# Altium project SML_Control_board.PrjPcb (part 1 of 2)
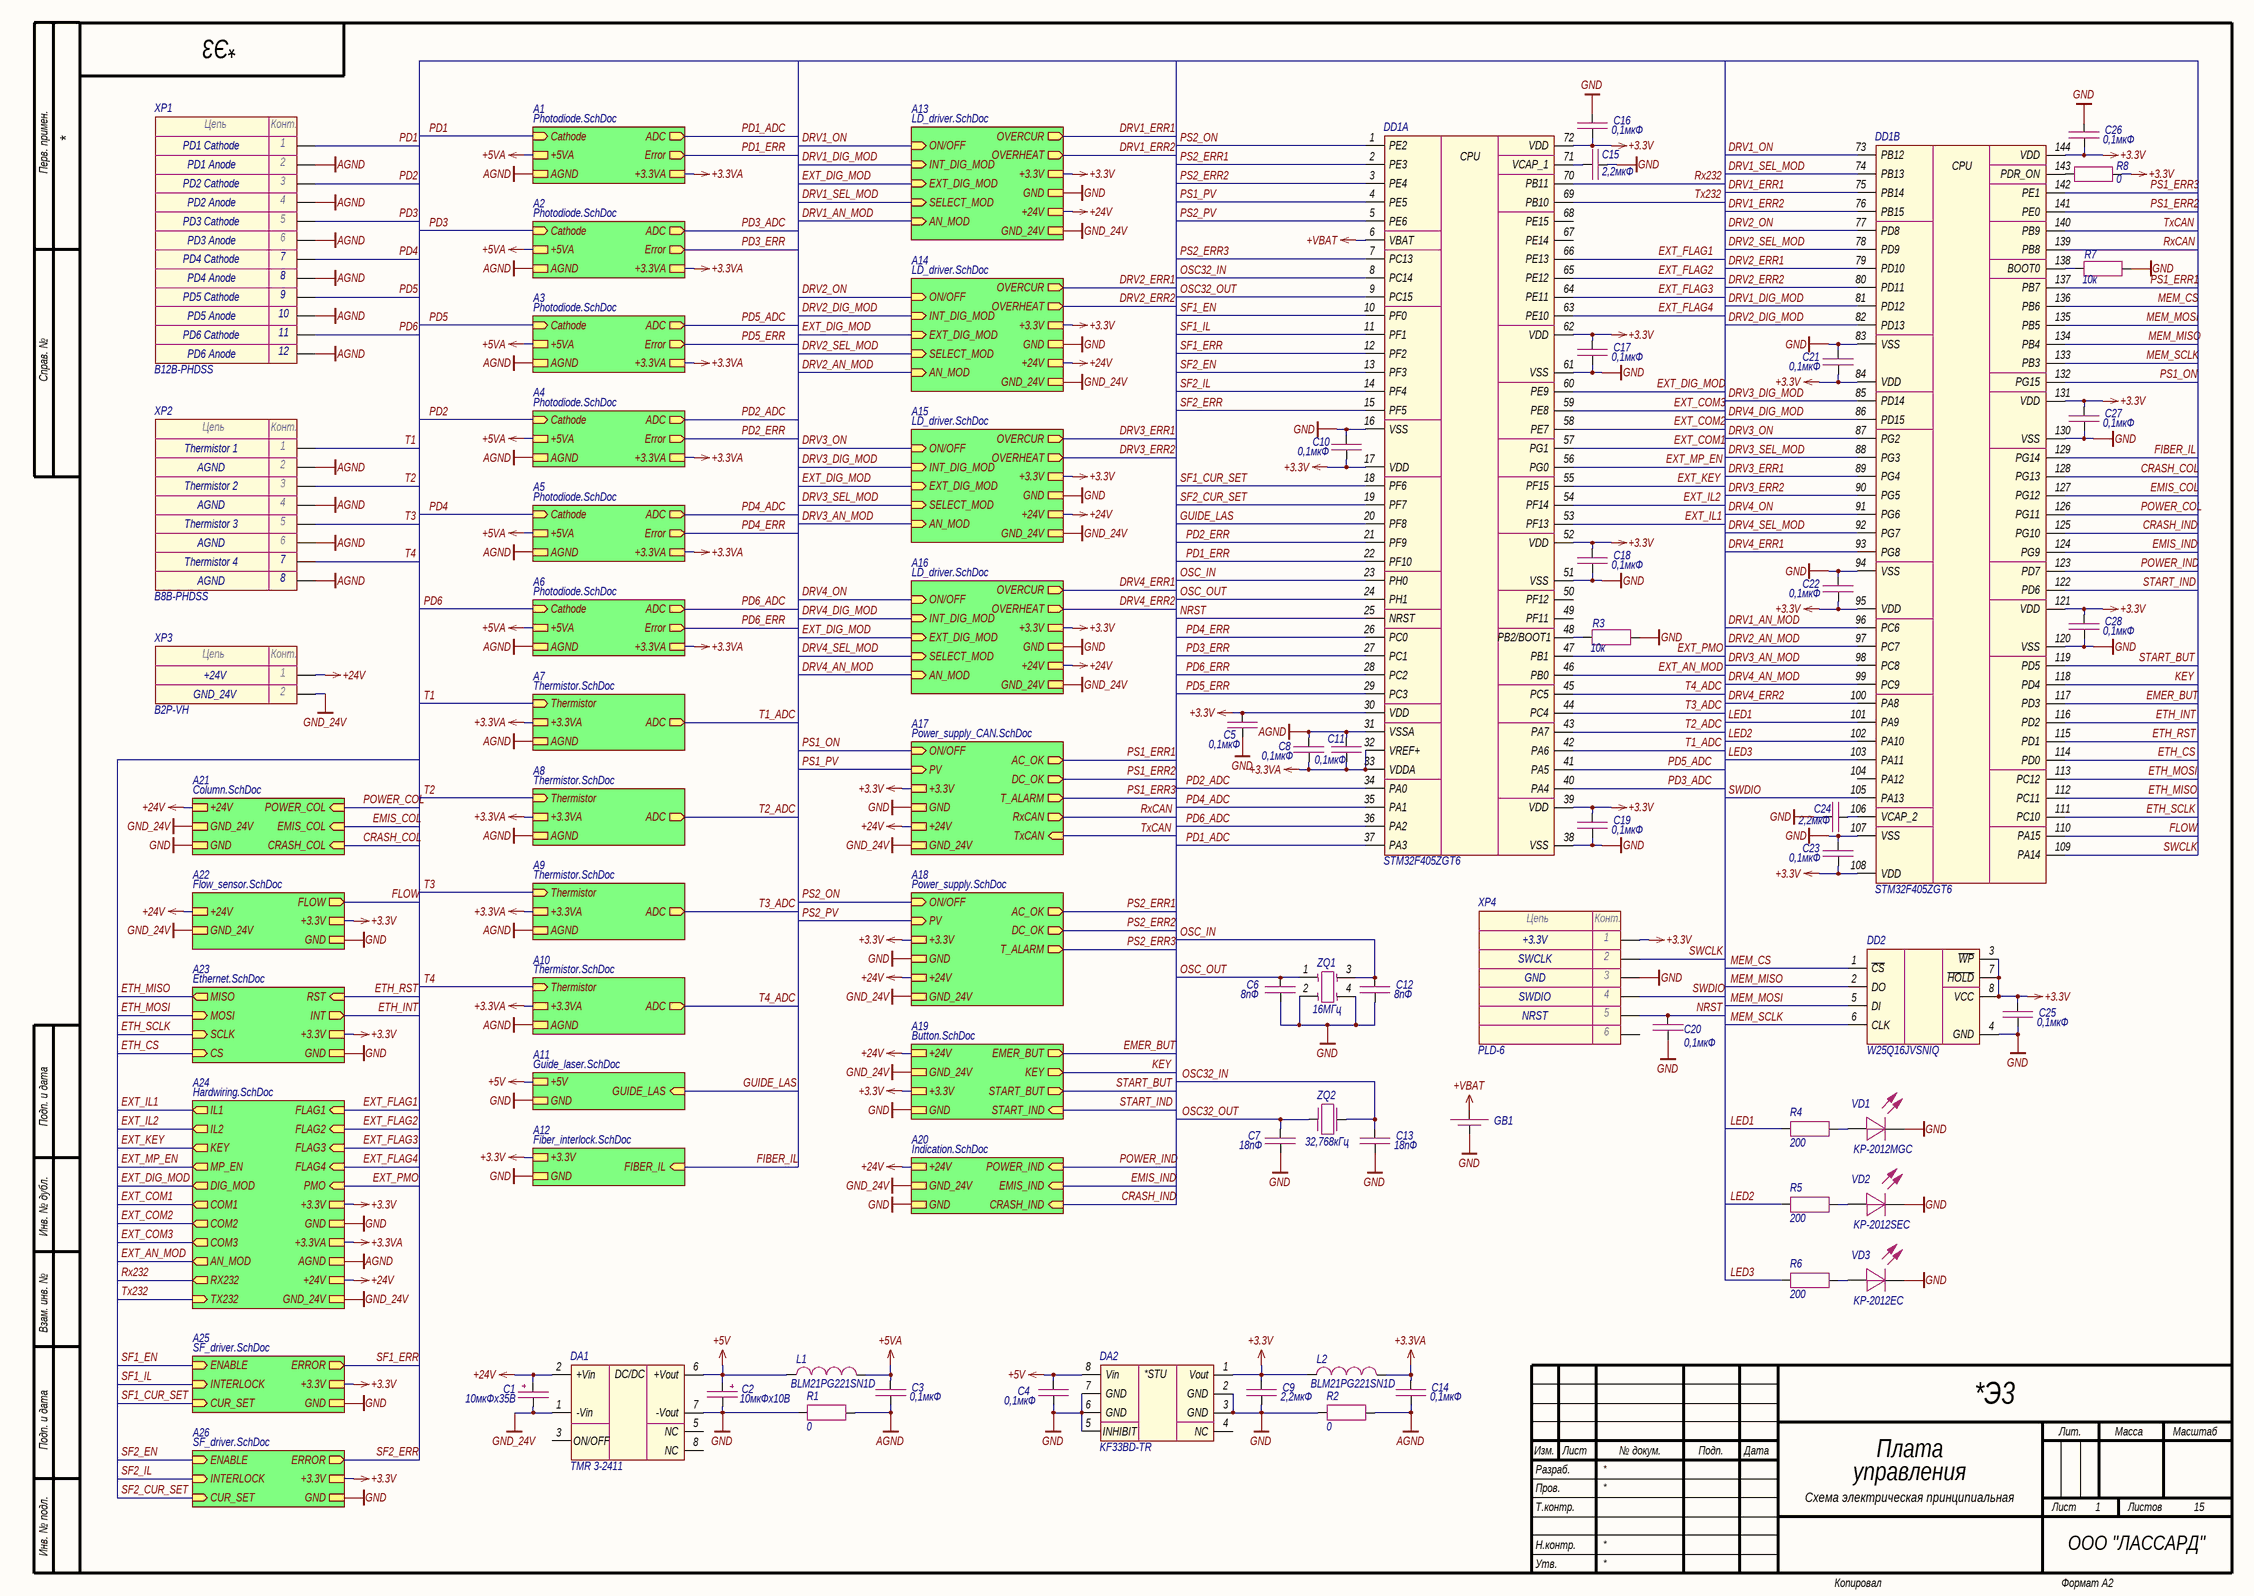
[diagram p0: Main.SchDoc]
15 sheets, 504 parts. Net scope: strictly hierarchical (ports join the sheet entries above them; power ports are local).
Board file: PCB1.PcbDoc
Sheets:
  Main.SchDoc
    A1 = Photodiode.SchDoc
    A2 = Photodiode.SchDoc
    A3 = Photodiode.SchDoc
    A4 = Photodiode.SchDoc
    A5 = Photodiode.SchDoc
    A6 = Photodiode.SchDoc
    A7 = Thermistor.SchDoc
    A8 = Thermistor.SchDoc
    A9 = Thermistor.SchDoc
    A10 = Thermistor.SchDoc
    A11 = Guide_laser.SchDoc
    A13 = LD_driver.SchDoc
    A14 = LD_driver.SchDoc
    A15 = LD_driver.SchDoc
    A16 = LD_driver.SchDoc
    A17 = Power_supply_CAN.SchDoc
    A18 = Power_supply.SchDoc
    A12 = Fiber_interlock.SchDoc
    A19 = Button.SchDoc
    A20 = Indication.SchDoc
    A21 = Column.SchDoc
    A22 = Flow_sensor.SchDoc
    A23 = Ethernet.SchDoc
    A24 = Hardwiring.SchDoc
    A25 = SF_driver.SchDoc
    A26 = SF_driver.SchDoc

## Sheet Main.SchDoc: Плата
size 594 x 420 mm; CompanyName: ООО "ЛАССАРД"; Address1: Address1; Address2: Address2; Address3: Address3; Address4: Address4; DocumentNumber: *Э3; SheetNumber: 1; SheetTotal: 15; Title2str: управления; DocumentType: Схема электрическая принципиальная

### Parts
C1  10мкФх35B  [CAP_C]
C2  10мкФх10B  [CAP_A]
C3  0,1мкФ  [CAP_0603]
C4  0,1мкФ  [CAP_0603]
C5  0,1мкФ  [CAP_0603]
C6  8пФ  [CAP_0603]
C7  18пФ  [CAP_0603]
C8  0,1мкФ  [CAP_0603]
C9  2,2мкФ  [CAP_0603]
C10  0,1мкФ  [CAP_0603]
C11  0,1мкФ  [CAP_0603]
C12  8пФ  [CAP_0603]
C13  18пФ  [CAP_0603]
C14  0,1мкФ  [CAP_0603]
C15  2,2мкФ  [CAP_0603]
C16  0,1мкФ  [CAP_0603]
C17  0,1мкФ  [CAP_0603]
C18  0,1мкФ  [CAP_0603]
C19  0,1мкФ  [CAP_0603]
C20  0,1мкФ  [CAP_0603]
C21  0,1мкФ  [CAP_0603]
C22  0,1мкФ  [CAP_0603]
C23  0,1мкФ  [CAP_0603]
C24  2,2мкФ  [CAP_0603]
C25  0,1мкФ  [CAP_0603]
C26  0,1мкФ  [CAP_0603]
C27  0,1мкФ  [CAP_0603]
C28  0,1мкФ  [CAP_0603]
DA1  TMR 3-2411  [TMR3 (SIP-8)]
DA2  KF33BD-TR  [SOIC-8]
DD1  STM32F405ZGT6  [LQFP-144]  (parts A,B of 2)
DD2  W25Q16JVSNIQ  [SOIC-8]
GB1  DS1092-12-N8S  [DS1092-12-N8S]  (value not drawn)
L1  BLM21PG221SN1D  [IND_0805]
L2  BLM21PG221SN1D  [IND_0805]
R1  0  [RES_0805]
R2  0  [RES_0805]
R3  10к  [RES_0603]
R4  200  [RES_0603]
R5  200  [RES_0603]
R6  200  [RES_0603]
R7  10к  [RES_0603]
R8  0  [RES_0603]
VD1  KP-2012MGC  [LED_0805]
VD2  KP-2012SEC  [LED_0805]
VD3  KP-2012EC  [LED_0805]
XP1  B12B-PHDSS  [B12B-PHDSS]
XP2  B8B-PHDSS  [B8B-PHDSS]
XP3  B2P-VH  [B2P-VH]
XP4  PLD-6  [PLD-6]
ZQ1  16МГц  [NX2520SA]
ZQ2  32,768кГц  [NX3215SA]

### Sub-sheets
A1 = Photodiode.SchDoc: Cathode (in), ADC (out), Error (out), AGND, +5VA, +3.3VA
A2 = Photodiode.SchDoc: Cathode (in), ADC (out), Error (out), AGND, +5VA, +3.3VA
A3 = Photodiode.SchDoc: Cathode (in), ADC (out), Error (out), AGND, +5VA, +3.3VA
A4 = Photodiode.SchDoc: Cathode (in), ADC (out), Error (out), AGND, +5VA, +3.3VA
A5 = Photodiode.SchDoc: Cathode (in), ADC (out), Error (out), AGND, +5VA, +3.3VA
A6 = Photodiode.SchDoc: Cathode (in), ADC (out), Error (out), AGND, +5VA, +3.3VA
A7 = Thermistor.SchDoc: Thermistor (in), +3.3VA, AGND, ADC (out)
A8 = Thermistor.SchDoc: Thermistor (in), +3.3VA, AGND, ADC (out)
A9 = Thermistor.SchDoc: Thermistor (in), +3.3VA, AGND, ADC (out)
A10 = Thermistor.SchDoc: Thermistor (in), +3.3VA, AGND, ADC (out)
A11 = Guide_laser.SchDoc: GUIDE_LAS (in), +5V, GND
A12 = Fiber_interlock.SchDoc: FIBER_IL (in), +3.3V, GND
A13 = LD_driver.SchDoc: +3.3V, GND, OVERCUR (out), OVERHEAT (out), +24V, GND_24V, ON/OFF (in), INT_DIG_MOD (in), AN_MOD (in), EXT_DIG_MOD (in), SELECT_MOD (in)
A14 = LD_driver.SchDoc: +3.3V, GND, OVERCUR (out), OVERHEAT (out), +24V, GND_24V, ON/OFF (in), INT_DIG_MOD (in), AN_MOD (in), EXT_DIG_MOD (in), SELECT_MOD (in)
A15 = LD_driver.SchDoc: +3.3V, GND, OVERCUR (out), OVERHEAT (out), +24V, GND_24V, ON/OFF (in), INT_DIG_MOD (in), AN_MOD (in), EXT_DIG_MOD (in), SELECT_MOD (in)
A16 = LD_driver.SchDoc: +3.3V, GND, OVERCUR (out), OVERHEAT (out), +24V, GND_24V, ON/OFF (in), INT_DIG_MOD (in), AN_MOD (in), EXT_DIG_MOD (in), SELECT_MOD (in)
A17 = Power_supply_CAN.SchDoc: ON/OFF (in), PV (in), +3.3V, GND, +24V, GND_24V, AC_OK (out), DC_OK (out), RxCAN (out), TxCAN (in), T_ALARM (out)
A18 = Power_supply.SchDoc: ON/OFF (in), PV (in), +3.3V, GND, +24V, GND_24V, AC_OK (out), DC_OK (out), T_ALARM (out)
A19 = Button.SchDoc: EMER_BUT (out), +24V, GND_24V, +3.3V, GND, KEY (out), START_BUT (out), START_IND (in)
A20 = Indication.SchDoc: GND_24V, +24V, CRASH_IND (in), POWER_IND (in), EMIS_IND (in), GND
A21 = Column.SchDoc: GND_24V, +24V, CRASH_COL (in), POWER_COL (in), EMIS_COL (in), GND
A22 = Flow_sensor.SchDoc: FLOW (out), +24V, GND_24V, +3.3V, GND
A23 = Ethernet.SchDoc: MISO (out), RST (in), MOSI (in), INT (out), SCLK (in), CS (in), +3.3V, GND
A24 = Hardwiring.SchDoc: IL1 (out), FLAG1 (in), RX232 (out), TX232 (in), IL2 (out), KEY (out), MP_EN (out), AN_MOD (out), FLAG2 (in), FLAG3 (in), FLAG4 (in), PMO (in), +3.3VA, AGND, +3.3V, GND, GND_24V, +24V, COM1 (out), COM2 (out), COM3 (out), DIG_MOD (out)
A25 = SF_driver.SchDoc: ENABLE (in), ERROR (out), +3.3V, GND, INTERLOCK (in), CUR_SET (in)
A26 = SF_driver.SchDoc: ENABLE (in), ERROR (out), +3.3V, GND, INTERLOCK (in), CUR_SET (in)

### Nets
+3.3V: C5.1 C9.1 C10.2 C16.2 C17.1 C18.1 C19.1 C21.2 C22.2 C23.2 C25.1 C26.2 C27.1 C28.1 DA2.1(Vout) DD1.17(VDD) DD1.30(VDD) DD1.39(VDD) DD1.52(VDD) DD1.62(VDD) DD1.72(VDD) DD1.84(VDD) DD1.95(VDD) DD1.108(VDD) DD1.121(VDD) DD1.131(VDD) DD1.144(VDD) DD2.3(~{WP}) DD2.7(~{HOLD}) DD2.8(VCC) L2.1 R8.2 XP4.1 ; sheet A13/+3.3V, sheet A14/+3.3V, sheet A15/+3.3V, sheet A16/+3.3V, sheet A17/+3.3V, sheet A18/+3.3V, sheet A12/+3.3V, sheet A19/+3.3V, sheet A22/+3.3V, sheet A23/+3.3V, sheet A24/+3.3V, sheet A25/+3.3V, sheet A26/+3.3V
+3.3VA: C8.2 C11.2 C14.1 DD1.32(VREF+) DD1.33(VDDA) L2.2 ; sheet A1/+3.3VA, sheet A2/+3.3VA, sheet A3/+3.3VA, sheet A4/+3.3VA, sheet A5/+3.3VA, sheet A6/+3.3VA, sheet A7/+3.3VA, sheet A8/+3.3VA, sheet A9/+3.3VA, sheet A10/+3.3VA, sheet A24/+3.3VA
+5V: C2.1 C4.1 DA1.6(+Vout) DA2.8(Vin) L1.1 ; sheet A11/+5V
+5VA: C3.1 L1.2 ; sheet A1/+5VA, sheet A2/+5VA, sheet A3/+5VA, sheet A4/+5VA, sheet A5/+5VA, sheet A6/+5VA
+24V: C1.1 DA1.2(+Vin) XP3.1 ; sheet A13/+24V, sheet A14/+24V, sheet A15/+24V, sheet A16/+24V, sheet A17/+24V, sheet A18/+24V, sheet A19/+24V, sheet A20/+24V, sheet A21/+24V, sheet A22/+24V, sheet A24/+24V
+VBAT: DD1.6(VBAT) GB1.2
AGND: C3.2 C8.1 C11.1 C14.2 DD1.31(VSSA) R1.2 R2.2 XP1.2 XP1.4 XP1.6 XP1.8 XP1.10 XP1.12 XP2.2 XP2.4 XP2.6 XP2.8 ; sheet A1/AGND, sheet A2/AGND, sheet A3/AGND, sheet A4/AGND, sheet A5/AGND, sheet A6/AGND, sheet A7/AGND, sheet A8/AGND, sheet A9/AGND, sheet A10/AGND, sheet A24/AGND
GND: C2.2 C4.2 C5.2 C6.2 C7.2 C9.2 C10.1 C12.2 C13.2 C15.2 C16.1 C17.2 C18.2 C19.2 C20.2 C21.1 C22.1 C23.1 C24.2 C25.2 C26.1 C27.2 C28.2 DA1.7(-Vout) DA2.2(GND) DA2.3(GND) DA2.5(INHIBIT) DA2.6(GND) DA2.7(GND) DD1.16(VSS) DD1.38(VSS) DD1.51(VSS) DD1.61(VSS) DD1.83(VSS) DD1.94(VSS) DD1.107(VSS) DD1.120(VSS) DD1.130(VSS) DD2.4(GND) GB1.1 R1.1 R2.1 R3.2 R7.2 VD1.2(C) VD2.2(C) VD3.2(C) XP4.3 ZQ1.2 ZQ1.4 ; sheet A11/GND, sheet A13/GND, sheet A14/GND, sheet A15/GND, sheet A16/GND, sheet A17/GND, sheet A18/GND, sheet A12/GND, sheet A19/GND, sheet A20/GND, sheet A21/GND, sheet A22/GND, sheet A23/GND, sheet A24/GND, sheet A25/GND, sheet A26/GND
GND_24V: C1.2 DA1.1(-Vin) XP3.2 ; sheet A13/GND_24V, sheet A14/GND_24V, sheet A15/GND_24V, sheet A16/GND_24V, sheet A17/GND_24V, sheet A18/GND_24V, sheet A19/GND_24V, sheet A20/GND_24V, sheet A21/GND_24V, sheet A22/GND_24V, sheet A24/GND_24V
CRASH_COL: DD1.128(PG13) ; sheet A21/CRASH_COL
CRASH_IND: DD1.125(PG10) ; sheet A20/CRASH_IND
DRV1_AN_MOD: DD1.96(PC6) ; sheet A13/AN_MOD
DRV1_DIG_MOD: DD1.81(PD12) ; sheet A13/INT_DIG_MOD
DRV1_ERR1: DD1.75(PB14) ; sheet A13/OVERCUR
DRV1_ERR2: DD1.76(PB15) ; sheet A13/OVERHEAT
DRV1_ON: DD1.73(PB12) ; sheet A13/ON/OFF
DRV1_SEL_MOD: DD1.74(PB13) ; sheet A13/SELECT_MOD
DRV2_AN_MOD: DD1.97(PC7) ; sheet A14/AN_MOD
DRV2_DIG_MOD: DD1.82(PD13) ; sheet A14/INT_DIG_MOD
DRV2_ERR1: DD1.79(PD10) ; sheet A14/OVERCUR
DRV2_ERR2: DD1.80(PD11) ; sheet A14/OVERHEAT
DRV2_ON: DD1.77(PD8) ; sheet A14/ON/OFF
DRV2_SEL_MOD: DD1.78(PD9) ; sheet A14/SELECT_MOD
DRV3_AN_MOD: DD1.98(PC8) ; sheet A15/AN_MOD
DRV3_DIG_MOD: DD1.85(PD14) ; sheet A15/INT_DIG_MOD
DRV3_ERR1: DD1.89(PG4) ; sheet A15/OVERCUR
DRV3_ERR2: DD1.90(PG5) ; sheet A15/OVERHEAT
DRV3_ON: DD1.87(PG2) ; sheet A15/ON/OFF
DRV3_SEL_MOD: DD1.88(PG3) ; sheet A15/SELECT_MOD
DRV4_AN_MOD: DD1.99(PC9) ; sheet A16/AN_MOD
DRV4_DIG_MOD: DD1.86(PD15) ; sheet A16/INT_DIG_MOD
DRV4_ERR1: DD1.93(PG8) ; sheet A16/OVERCUR
DRV4_ERR2: DD1.100(PA8) ; sheet A16/OVERHEAT
DRV4_ON: DD1.91(PG6) ; sheet A16/ON/OFF
DRV4_SEL_MOD: DD1.92(PG7) ; sheet A16/SELECT_MOD
EMER_BUT: DD1.117(PD3) ; sheet A19/EMER_BUT
EMIS_COL: DD1.127(PG12) ; sheet A21/EMIS_COL
EMIS_IND: DD1.124(PG9) ; sheet A20/EMIS_IND
ETH_CS: DD1.114(PD0) ; sheet A23/CS
ETH_INT: DD1.116(PD2) ; sheet A23/INT
ETH_MISO: DD1.112(PC11) ; sheet A23/MISO
ETH_MOSI: DD1.113(PC12) ; sheet A23/MOSI
ETH_RST: DD1.115(PD1) ; sheet A23/RST
ETH_SCLK: DD1.111(PC10) ; sheet A23/SCLK
EXT_AN_MOD: DD1.46(PB0) ; sheet A24/AN_MOD
EXT_COM1: DD1.57(PG1) ; sheet A24/COM1
EXT_COM2: DD1.58(PE7) ; sheet A24/COM2
EXT_COM3: DD1.59(PE8) ; sheet A24/COM3
EXT_DIG_MOD: DD1.60(PE9) ; sheet A13/EXT_DIG_MOD, sheet A14/EXT_DIG_MOD, sheet A15/EXT_DIG_MOD, sheet A16/EXT_DIG_MOD, sheet A24/DIG_MOD
EXT_FLAG1: DD1.66(PE13) ; sheet A24/FLAG1
EXT_FLAG2: DD1.65(PE12) ; sheet A24/FLAG2
EXT_FLAG3: DD1.64(PE11) ; sheet A24/FLAG3
EXT_FLAG4: DD1.63(PE10) ; sheet A24/FLAG4
EXT_IL1: DD1.53(PF13) ; sheet A24/IL1
EXT_IL2: DD1.54(PF14) ; sheet A24/IL2
EXT_KEY: DD1.55(PF15) ; sheet A24/KEY
EXT_MP_EN: DD1.56(PG0) ; sheet A24/MP_EN
EXT_PMO: DD1.47(PB1) ; sheet A24/PMO
FIBER_IL: DD1.129(PG14) ; sheet A12/FIBER_IL
FLOW: DD1.110(PA15) ; sheet A22/FLOW
GUIDE_LAS: DD1.20(PF8) ; sheet A11/GUIDE_LAS
KEY: DD1.118(PD4) ; sheet A19/KEY
LED1: DD1.101(PA9) R4.1
LED2: DD1.102(PA10) R5.1
LED3: DD1.103(PA11) R6.1
MEM_CS: DD1.136(PB6) DD2.1(~{CS})
MEM_MISO: DD1.134(PB4) DD2.2(DO)
MEM_MOSI: DD1.135(PB5) DD2.5(DI)
MEM_SCLK: DD1.133(PB3) DD2.6(CLK)
NRST: C20.1 DD1.25(NRST) XP4.5
OSC32_IN: C13.1 DD1.8(PC14) ZQ2.2
OSC32_OUT: C7.1 DD1.9(PC15) ZQ2.1
OSC_IN: C12.1 DD1.23(PH0) ZQ1.3
OSC_OUT: C6.1 DD1.24(PH1) ZQ1.1
PD1: XP1.1 ; sheet A1/Cathode
PD1_ADC: DD1.37(PA3) ; sheet A1/ADC
PD1_ERR: DD1.22(PF10) ; sheet A1/Error
PD2: XP1.3 ; sheet A4/Cathode
PD2_ADC: DD1.34(PA0) ; sheet A4/ADC
PD2_ERR: DD1.21(PF9) ; sheet A4/Error
PD3: XP1.5 ; sheet A2/Cathode
PD3_ADC: DD1.40(PA4) ; sheet A2/ADC
PD3_ERR: DD1.27(PC1) ; sheet A2/Error
PD4: XP1.7 ; sheet A5/Cathode
PD4_ADC: DD1.35(PA1) ; sheet A5/ADC
PD4_ERR: DD1.26(PC0) ; sheet A5/Error
PD5: XP1.9 ; sheet A3/Cathode
PD5_ADC: DD1.41(PA5) ; sheet A3/ADC
PD5_ERR: DD1.29(PC3) ; sheet A3/Error
PD6: XP1.11 ; sheet A6/Cathode
PD6_ADC: DD1.36(PA2) ; sheet A6/ADC
PD6_ERR: DD1.28(PC2) ; sheet A6/Error
POWER_COL: DD1.126(PG11) ; sheet A21/POWER_COL
POWER_IND: DD1.123(PD7) ; sheet A20/POWER_IND
PS1_ERR1: DD1.137(PB7) ; sheet A17/AC_OK
PS1_ERR2: DD1.141(PE0) ; sheet A17/DC_OK
PS1_ERR3: DD1.142(PE1) ; sheet A17/T_ALARM
PS1_ON: DD1.132(PG15) ; sheet A17/ON/OFF
PS1_PV: DD1.4(PE5) ; sheet A17/PV
PS2_ERR1: DD1.2(PE3) ; sheet A18/AC_OK
PS2_ERR2: DD1.3(PE4) ; sheet A18/DC_OK
PS2_ERR3: DD1.7(PC13) ; sheet A18/T_ALARM
PS2_ON: DD1.1(PE2) ; sheet A18/ON/OFF
PS2_PV: DD1.5(PE6) ; sheet A18/PV
Rx232: DD1.70(PB11) ; sheet A24/RX232
RxCAN: DD1.139(PB8) ; sheet A17/RxCAN
SF1_CUR_SET: DD1.18(PF6) ; sheet A25/CUR_SET
SF1_EN: DD1.10(PF0) ; sheet A25/ENABLE
SF1_ERR: DD1.12(PF2) ; sheet A25/ERROR
SF1_IL: DD1.11(PF1) ; sheet A25/INTERLOCK
SF2_CUR_SET: DD1.19(PF7) ; sheet A26/CUR_SET
SF2_EN: DD1.13(PF3) ; sheet A26/ENABLE
SF2_ERR: DD1.15(PF5) ; sheet A26/ERROR
SF2_IL: DD1.14(PF4) ; sheet A26/INTERLOCK
START_BUT: DD1.119(PD5) ; sheet A19/START_BUT
START_IND: DD1.122(PD6) ; sheet A19/START_IND
SWCLK: DD1.109(PA14) XP4.2
SWDIO: DD1.105(PA13) XP4.4
T1: XP2.1 ; sheet A7/Thermistor
T1_ADC: DD1.42(PA6) ; sheet A7/ADC
T2: XP2.3 ; sheet A8/Thermistor
T2_ADC: DD1.43(PA7) ; sheet A8/ADC
T3: XP2.5 ; sheet A9/Thermistor
T3_ADC: DD1.44(PC4) ; sheet A9/ADC
T4: XP2.7 ; sheet A10/Thermistor
T4_ADC: DD1.45(PC5) ; sheet A10/ADC
Tx232: DD1.69(PB10) ; sheet A24/TX232
TxCAN: DD1.140(PB9) ; sheet A17/TxCAN
NetC15_1: C15.1 DD1.71(VCAP_1)
NetC24_1: C24.1 DD1.106(VCAP_2)
NetDD1_48: DD1.48(PB2/BOOT1) R3.1
NetDD1_138: DD1.138(BOOT0) R7.1
NetDD1_143: DD1.143(PDR_ON) R8.1
NetR4_2: R4.2 VD1.1(A)
NetR5_2: R5.2 VD2.1(A)
NetR6_2: R6.2 VD3.1(A)

Not connected (* = marked no-connect by the designer): DA1 3(ON/OFF) 5(NC) 8(NC); DA2 4(NC); DD1 49(PF11) 50(PF12) 67(PE14) 68(PE15) 104(PA12); XP4 6

### Notes on the sheet
- PD1 Cathode
- PD1 Anode
- PD2 Cathode
- PD2 Anode
- PD3 Cathode
- PD3 Anode
- PD4 Cathode
- PD4 Anode
- PD5 Cathode
- PD5 Anode
- PD6 Cathode
- PD6 Anode
- Thermistor 1
- AGND
- Thermistor 2
- Thermistor 3
- Thermistor 4
- +24V
- GND_24V
- +3.3V
- GND
- SWCLK
- SWDIO
- NRST
- Перв. примен.
- Справ. №
- Подп. и дата
- Инв. № дубл.
- Взам. инв. №
- Разраб.
- Изм.
- Лист
- № докум.
- Подп.
- Дата
- Лит.
- Масса
- Масштаб
- Пров.
- Т.контр.
- Листов
- Инв. № подл.
- Утв.
- Н.контр.
- Копировал
- Формат А2
- (in symbol Connector-2) Цепь; Конт.
- (in symbol Connector-8) Цепь; Конт.
- (in symbol Connector-12) Цепь; Конт.
- (in symbol KFXXBD-TR) *STU
- (in symbol STM32F405ZG, part A) CPU
- (in symbol STM32F405ZG, part B) CPU
- (in symbol TMR3) DC/DC

### Library data of the parts
C1 = Capacitor_Polar: Model: TECAP, 10 мкФ, 35 В, тип C, 10%; Value: 10мкФх35B; Document: *; Manufacturer: *
C2 = Capacitor_Polar: Model: TECAP, 10 мкФ, 10 В, тип A, 10%; Value: 10мкФх10B; Document: *; Manufacturer: *
C3-C5 C8 C10 C11 C14 C16-C23 C25-C28 = Capacitor: Manufacturer: Murata; Model: GRM188R71H104KA93D; Value: 0,1мкФ; Document: *
C6 C12 = Capacitor: Manufacturer: Yageo; Model: CC0603CRNPO9BN8R0; Value: 8пФ; Document: *
C7 C13 = Capacitor: Manufacturer: Murata; Model: GRM1885C1H180FA01D; Value: 18пФ; Document: *
C9 C15 C24 = Capacitor: Manufacturer: Murata; Model: GRM188R61H225KE11D; Value: 2,2мкФ; Document: *
DA1 = TMR3: Manufacturer: Traco Power; Model: TMR 3-2411; Document: *
DA2 = KFXXBD-TR: Manufacturer: STMicroelectronics; Model: KF33BD-TR; Document: *
DD1 = STM32F405ZG: Manufacturer: STMicroelectronics; Model: STM32F405ZGT6; Document: *
DD2 = W25Q: Manufacturer: Winbond; Model: W25Q16JVSNIQ; Document: *
GB1 = Accumulator: Manufacturer: Connfly; Model: DS1092-12-N8S; Document: *
L1 L2 = Inductor: Manufacturer: Murata; Value: *; Model: BLM21PG221SN1D; Document: *
R1 R2 = Resistor: Manufacturer: Yageo; Model: RC0805FR-070RL; Value: 0; Document: *
R3 R7 = Resistor: Manufacturer: Yageo; Model: RC0603FR-0710KL; Value: 10к; Document: *
R4-R6 = Resistor: Manufacturer: Yageo; Model: RC0603FR-07200RL; Value: 200; Document: *
R8 = Resistor: Manufacturer: Yageo; Model: RC0603JR-070RL; Value: 0; Document: *
VD1-VD3 = LED: Manufacturer: Kingbright; Document: *
  VD1: Model: KP-2012MGC
  VD2: Model: KP-2012SEC
  VD3: Model: KP-2012EC
XP1 = Connector-12: Manufacturer: JST; Model: B12B-PHDSS; Document: *
XP2 = Connector-8: Manufacturer: JST; Model: B8B-PHDSS; Document: *
XP3 = Connector-2: Manufacturer: JST; Model: B2P-VH; Document: *
XP4 = Connector-6: Manufacturer: Connfly; Model: PLD-6; Document: *
ZQ1 = Quartz_Resonator_4-pin: Manufacturer: NDK; Model: NX2520SA-16MHZ-STD-CSW-5; Value: 16МГц; Document: *
ZQ2 = Quartz_Resonator: Manufacturer: NDK; Model: NX3215SA- 32.768K-STD-MUA-8; Value: 32,768кГц; Document: *

## Sheet Photodiode.SchDoc
size 420 x 297 mm; Address1: Address1; Address2: Address2; Address3: Address3; Address4: Address4; DocumentNumber: *Э3; SheetNumber: 2; SheetTotal: 15; DocumentType: Схема электрическая *
Used 6 times, as channels A1, A2, A3, A4, A5, A6. Parts and nets are listed once, with the designators drawn on the sheet.
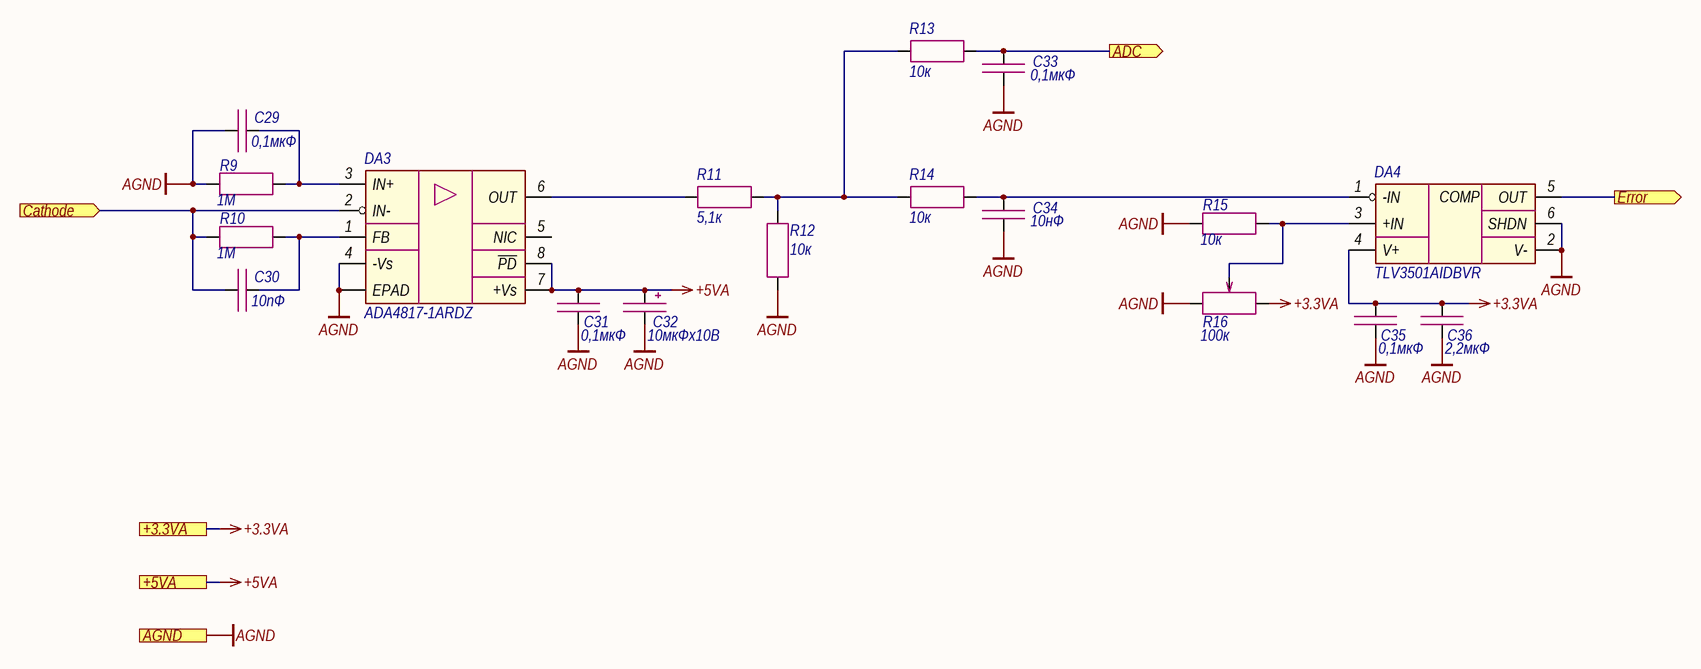
[diagram p1: Photodiode.SchDoc]

### Parts
C29  0,1мкФ  [CAP_0603]
C30  10пФ  [CAP_0603]
C31  0,1мкФ  [CAP_0603]
C32  10мкФх10B  [CAP_A]
C33  0,1мкФ  [CAP_0603]
C34  10нФ  [CAP_0603]
C35  0,1мкФ  [CAP_0603]
C36  2,2мкФ  [CAP_0603]
DA3  ADA4817-1ARDZ  [SOIC-8 EPAD]
DA4  TLV3501AIDBVR  [SOT-23-6]
R9  1М  [RES_0805]
R10  1М  [RES_0805]
R11  5,1к  [RES_0603]
R12  10к  [RES_0603]
R13  10к  [RES_0603]
R14  10к  [RES_0603]
R15  10к  [RES_0603]
R16  100к  [3224W]

### Ports
+3.3VA (see Main[2A], Hardwiring[4D], Thermistor[2C]), +5VA (see Main[1A]), ADC (out, see Main[2A]), AGND (see Main[1A], Hardwiring[4D], Thermistor[2C]), Cathode (in, see Main[1A]), Error (out, see Main[2A])

### Nets
+3.3VA: C35.1 C36.1 DA4.4(V+) R16.3 ; port +3.3VA
+5VA: C31.1 C32.1 DA3.7(+Vs) DA3.8(~{PD}) ; port +5VA
AGND: C29.1 C31.2 C32.2 C33.2 C34.2 C35.2 C36.2 DA3.4(-Vs) DA3.EPAD DA4.2(V-) DA4.6(SHDN) R9.2 R12.2 R15.1 R16.1 ; port AGND
ADC: C33.1 R13.2 ; port ADC
Cathode: C30.2 DA3.2(IN-) R10.2 ; port Cathode
Error: DA4.5(OUT) ; port Error
NetC29_2: C29.2 DA3.3(IN+) R9.1
NetC30_1: C30.1 DA3.1(FB) R10.1
NetC34_1: C34.1 DA4.1(-IN) R14.2
NetDA3_6: DA3.6(OUT) R11.1
NetDA4_3: DA4.3(+IN) R15.2 R16.2
NetR11_2: R11.2 R12.1 R13.1 R14.1

Not connected (* = marked no-connect by the designer): DA3 5(NIC)

### Channels
A1: designators end in A1; ports +3.3VA=+3.3VA +5VA=+5VA ADC=PD1_ADC AGND=AGND Cathode=PD1 Error=PD1_ERR
A2: designators end in A2; ports +3.3VA=+3.3VA +5VA=+5VA ADC=PD3_ADC AGND=AGND Cathode=PD3 Error=PD3_ERR
A3: designators end in A3; ports +3.3VA=+3.3VA +5VA=+5VA ADC=PD5_ADC AGND=AGND Cathode=PD5 Error=PD5_ERR
A4: designators end in A4; ports +3.3VA=+3.3VA +5VA=+5VA ADC=PD2_ADC AGND=AGND Cathode=PD2 Error=PD2_ERR
A5: designators end in A5; ports +3.3VA=+3.3VA +5VA=+5VA ADC=PD4_ADC AGND=AGND Cathode=PD4 Error=PD4_ERR
A6: designators end in A6; ports +3.3VA=+3.3VA +5VA=+5VA ADC=PD6_ADC AGND=AGND Cathode=PD6 Error=PD6_ERR

### Notes on the sheet
- Подп. и дата
- Инв. № дубл.
- Взам. инв. №
- Инв. № подл.
- Изм.
- Лист
- № докум.
- Подп.
- Дата
- Копировал
- Формат А3
- (in symbol TLV3501) COMP

### Library data of the parts
C29 C31 C33 C35 = Capacitor: as C3 on sheet Main; Value: 0,1мкФ; Document: *
C30 = Capacitor: Manufacturer: Murata; Model: GRM1885C1H100JA01D; Value: 10пФ; Document: *
C32 = Capacitor_Polar: Model: TECAP, 10 мкФ, 10 В, тип A, 10%; Value: 10мкФх10B; Document: *; Manufacturer: *
C34 = Capacitor: Manufacturer: Murata; Model: GRM188R71H103JA01D; Value: 10нФ; Document: *
C36 = Capacitor: as C9 on sheet Main; Value: 2,2мкФ; Document: *
DA3 = ADA4817-1ARDZ: Manufacturer: Analog Devices; Model: ADA4817-1ARDZ; Document: *
DA4 = TLV3501: Manufacturer: Texas Instruments; Model: TLV3501AIDBVR; Document: *
R9 R10 = Resistor: Manufacturer: Yageo; Model: RC0805FR-071ML; Value: 1М; Document: *
R11 = Resistor: Manufacturer: Yageo; Model: RC0603FR-075K1L; Value: 5,1к; Document: *
R12-R15 = Resistor: as R3 on sheet Main; Value: 10к; Document: *
R16 = Resistor_Variable: Manufacturer: Bourns; Model: 3224W-1-104E; Value: 100к; Document: *

## Sheet Thermistor.SchDoc
size 209 x 297 mm; Address1: Address1; Address2: Address2; Address3: Address3; Address4: Address4; DocumentNumber: *Э3; SheetNumber: 3; SheetTotal: 15; DocumentType: Схема электрическая *
Used 4 times, as channels A7, A8, A9, A10. Parts and nets are listed once, with the designators drawn on the sheet.
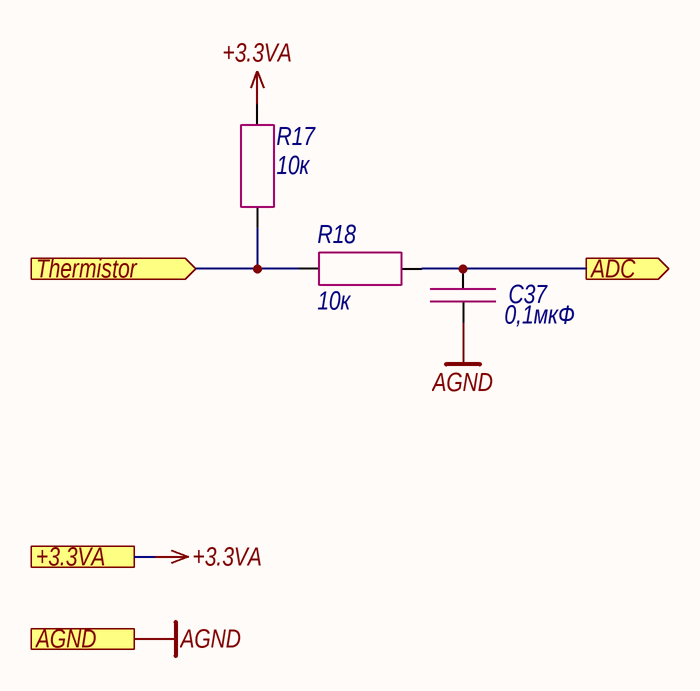
[diagram p2: Thermistor.SchDoc]

### Parts
C37  0,1мкФ  [CAP_0603]
R17  10к  [RES_0603]
R18  10к  [RES_0603]

### Ports
+3.3VA (see Main[1B], Hardwiring[4D], Photodiode[1C]), ADC (out, see Main[2B]), AGND (see Main[1B], Hardwiring[4D], Photodiode[1C]), Thermistor (in, see Main[1B])

### Nets
+3.3VA: R17.1 ; port +3.3VA
AGND: C37.2 ; port AGND
ADC: C37.1 R18.2 ; port ADC
Thermistor: R17.2 R18.1 ; port Thermistor

### Channels
A7: designators end in A7; ports +3.3VA=+3.3VA ADC=T1_ADC AGND=AGND Thermistor=T1
A8: designators end in A8; ports +3.3VA=+3.3VA ADC=T2_ADC AGND=AGND Thermistor=T2
A9: designators end in A9; ports +3.3VA=+3.3VA ADC=T3_ADC AGND=AGND Thermistor=T3
A10: designators end in A10; ports +3.3VA=+3.3VA ADC=T4_ADC AGND=AGND Thermistor=T4

### Notes on the sheet
- Подп. и дата
- Инв. № дубл.
- Взам. инв. №
- Инв. № подл.
- Изм.
- Лист
- № докум.
- Подп.
- Дата
- Копировал
- Формат А4

### Library data of the parts
C37 = Capacitor: as C3 on sheet Main; Value: 0,1мкФ; Document: *
R17 R18 = Resistor: as R3 on sheet Main; Value: 10к; Document: *

## Sheet Guide_laser.SchDoc
size 420 x 297 mm; Address1: Address1; Address2: Address2; Address3: Address3; Address4: Address4; DocumentNumber: *Э3; SheetNumber: 4; SheetTotal: 15; DocumentType: Схема электрическая *
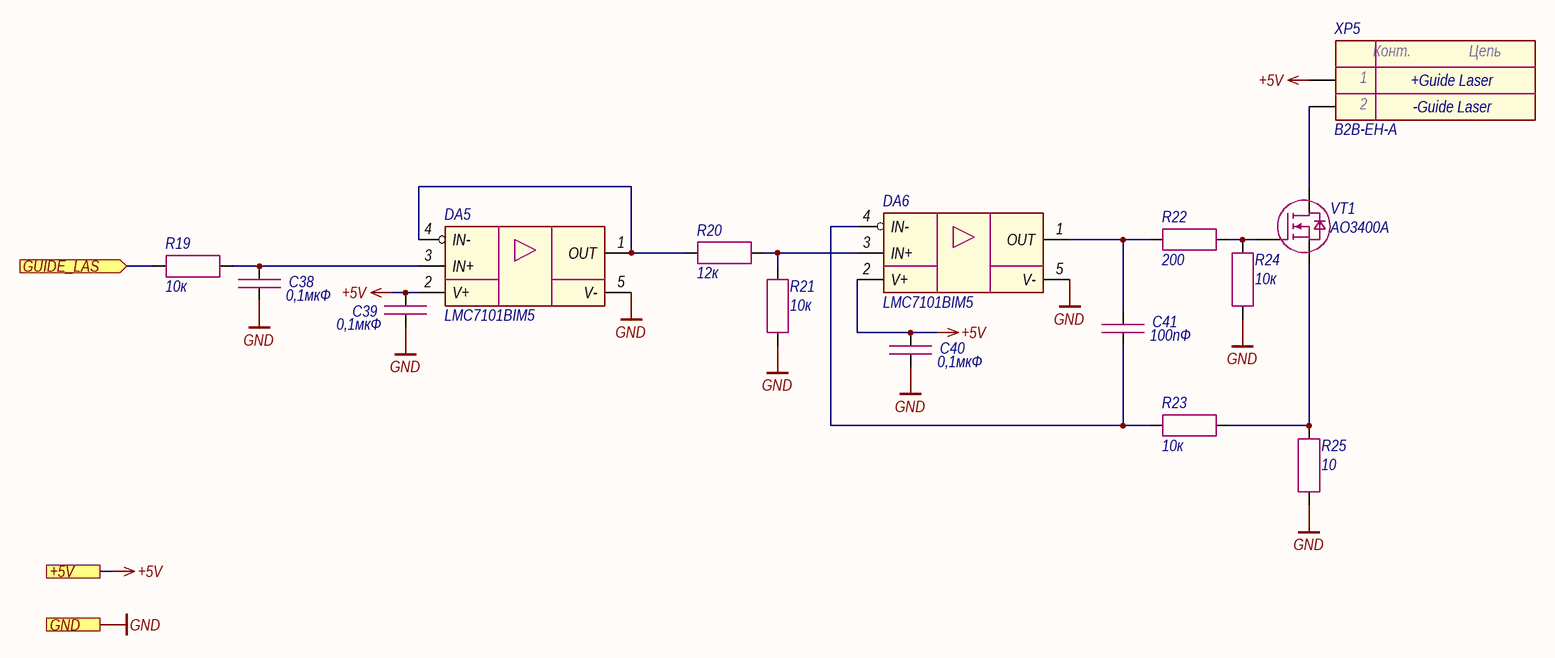
[diagram p3: Guide_laser.SchDoc]

### Parts
C38  0,1мкФ  [CAP_0603]
C39  0,1мкФ  [CAP_0603]
C40  0,1мкФ  [CAP_0603]
C41  100пФ  [CAP_0603]
DA5  LMC7101BIM5  [SOT-23-5]
DA6  LMC7101BIM5  [SOT-23-5]
R19  10к  [RES_0603]
R20  12к  [RES_0603]
R21  10к  [RES_0603]
R22  200  [RES_0603]
R23  10к  [RES_0603]
R24  10к  [RES_0603]
R25  10  [RES_1210]
VT1  AO3400A  [SOT-23-3]
XP5  B2B-EH-A  [B2B-EH-A]

### Ports
+5V (see Main[1C]), GND (see Main[1C], Button[1D], Column[1C], Ethernet[3D], Fiber_interlock[2C], Flow_sensor[2C], Hardwiring[3D], Indication[1C], LD_driver[1D], Power_supply[1D], Power_supply_CAN[1D], SF_driver[2D]), GUIDE_LAS (in, see Main[2C])

### Nets
+5V: C39.1 C40.1 DA5.2(V+) DA6.2(V+) XP5.1 ; port +5V
GND: C38.2 C39.2 C40.2 DA5.5(V-) DA6.5(V-) R21.2 R24.1 R25.1 ; port GND
GUIDE_LAS: R19.1 ; port GUIDE_LAS
NetC38_1: C38.1 DA5.3(IN+) R19.2
NetC41_1: C41.1 DA6.1(OUT) R22.1
NetC41_2: C41.2 DA6.4(IN-) R23.1
NetDA5_1: DA5.1(OUT) DA5.4(IN-) R20.1
NetDA6_3: DA6.3(IN+) R20.2 R21.1
NetR22_2: R22.2 R24.2 VT1.1(G)
NetR23_2: R23.2 R25.2 VT1.2(S)
NetVT1_3: VT1.3(D) XP5.2

### Notes on the sheet
- +Guide Laser
- -Guide Laser
- Подп. и дата
- Инв. № дубл.
- Взам. инв. №
- Инв. № подл.
- Изм.
- Лист
- № докум.
- Подп.
- Дата
- Копировал
- Формат А3
- (in symbol Connector-2) Конт.; Цепь

### Library data of the parts
C38-C40 = Capacitor: as C3 on sheet Main; Value: 0,1мкФ; Document: *
C41 = Capacitor: Manufacturer: Murata; Model: GRM1885C1H101JA01D; Value: 100пФ; Document: *
DA5 DA6 = LMC7101: Manufacturer: Texas Instruments; Model: LMC7101BIM5; Document: *
R19 R21 R23 R24 = Resistor: as R3 on sheet Main; Value: 10к; Document: *
R20 = Resistor: Manufacturer: Yageo; Model: RC0603FR-0712KL; Value: 12к; Document: *
R22 = Resistor: as R4 on sheet Main; Value: 200; Document: *
R25 = Resistor: Manufacturer: Yageo; Model: RC1210FR-0710RL; Value: 10; Document: *
VT1 = MOSFET N-channel: Manufacturer: UMW; Model: AO3400A; Document: *
XP5 = Connector-2: Manufacturer: JST; Model: B2B-EH-A; Document: *

## Sheet LD_driver.SchDoc
size 420 x 297 mm; Address1: Address1; Address2: Address2; Address3: Address3; Address4: Address4; DocumentNumber: *Э3; SheetNumber: 6; SheetTotal: 15; DocumentType: Схема электрическая *
Used 4 times, as channels A13, A14, A15, A16. Parts and nets are listed once, with the designators drawn on the sheet.
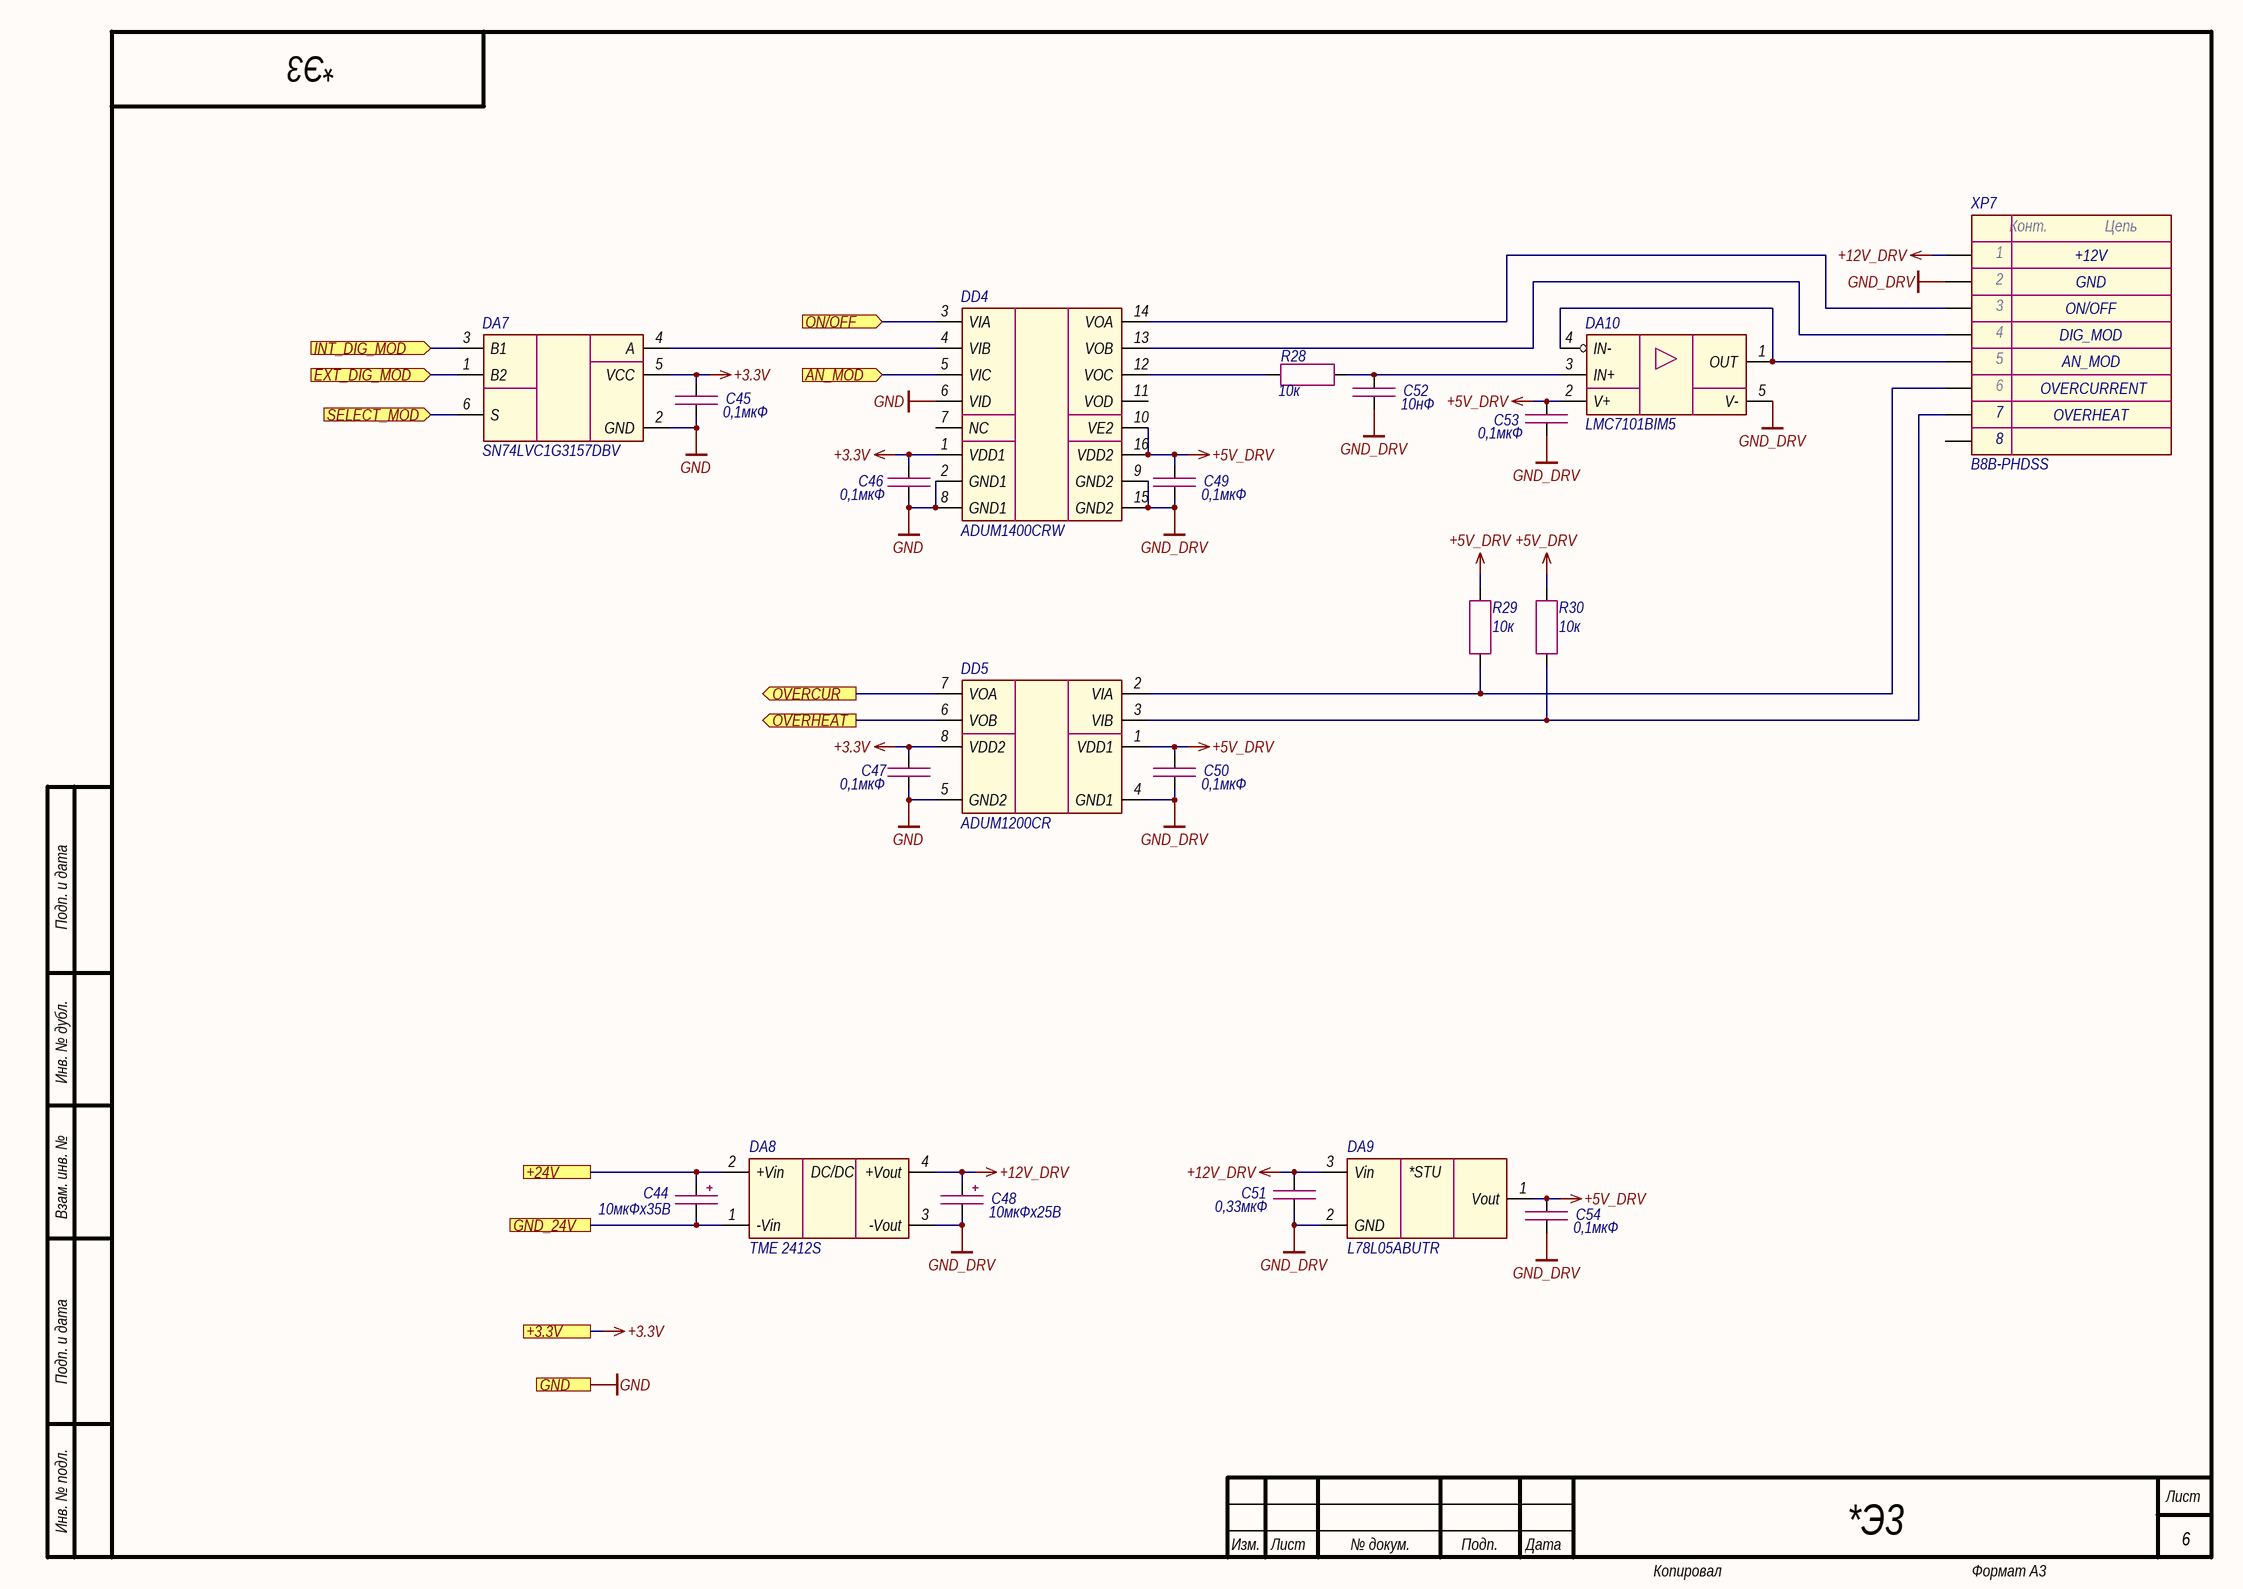
[diagram p4: LD_driver.SchDoc]

### Parts
C44  10мкФх35B  [CAP_C]
C45  0,1мкФ  [CAP_0603]
C46  0,1мкФ  [CAP_0603]
C47  0,1мкФ  [CAP_0603]
C48  10мкФх25B  [CAP_B]
C49  0,1мкФ  [CAP_0603]
C50  0,1мкФ  [CAP_0603]
C51  0,33мкФ  [CAP_0805]
C52  10нФ  [CAP_0603]
C53  0,1мкФ  [CAP_0603]
C54  0,1мкФ  [CAP_0603]
DA7  SN74LVC1G3157DBV  [SOT-23-6]
DA8  TME 2412S  [TME (SIP-4)]
DA9  L78L05ABUTR  [SOT-89]
DA10  LMC7101BIM5  [SOT-23-5]
DD4  ADUM1400CRW  [SOIC-16W]
DD5  ADUM1200CR  [SOIC-8]
R28  10к  [RES_0603]
R29  10к  [RES_0603]
R30  10к  [RES_0603]
XP7  B8B-PHDSS  [B8B-PHDSS]

### Ports
+3.3V (see Main[2A], Button[1D], Ethernet[3D], Fiber_interlock[2C], Flow_sensor[2C], Hardwiring[3D], Power_supply[1D], Power_supply_CAN[1D], SF_driver[2C]), +24V (see Main[2A], Button[1C], Column[1C], Flow_sensor[2C], Hardwiring[3C], Indication[1C], Power_supply[1D], Power_supply_CAN[1D]), AN_MOD (in, see Main[2A]), EXT_DIG_MOD (in, see Main[2A]), GND (see Main[2A], Button[1D], Column[1C], Ethernet[3D], Fiber_interlock[2C], Flow_sensor[2C], Guide_laser[1C], Hardwiring[3D], Indication[1C], Power_supply[1D], Power_supply_CAN[1D], SF_driver[2D]), GND_24V (see Main[2A], Button[1D], Column[1C], Flow_sensor[2C], Hardwiring[3C], Indication[1C], Power_supply[1D], Power_supply_CAN[1D]), INT_DIG_MOD (in, see Main[2A]), ON/OFF (in, see Main[2A]), OVERCUR (out, see Main[2A]), OVERHEAT (out, see Main[2A]), SELECT_MOD (in, see Main[2A])

### Nets
+3.3V: C45.1 C46.1 C47.1 DA7.5(VCC) DD4.1(VDD1) DD5.8(VDD2) ; port +3.3V
+5V_DRV: C49.1 C50.1 C53.1 C54.1 DA9.1(Vout) DA10.2(V+) DD4.10(VE2) DD4.16(VDD2) DD5.1(VDD1) R29.1 R30.1
+12V_DRV: C48.1 C51.2 DA8.4(+Vout) DA9.3(Vin) XP7.1
GND: C45.2 C46.2 C47.2 DA7.2(GND) DD4.2(GND1) DD4.6(VID) DD4.8(GND1) DD5.5(GND2) ; port GND
GND_DRV: C48.2 C49.2 C50.2 C51.1 C52.2 C53.2 C54.2 DA8.3(-Vout) DA9.2(GND) DA10.5(V-) DD4.9(GND2) DD4.15(GND2) DD5.4(GND1) XP7.2
+24V: C44.1 DA8.2(+Vin) ; port +24V
AN_MOD: DD4.5(VIC) ; port AN_MOD
EXT_DIG_MOD: DA7.1(B2) ; port EXT_DIG_MOD
GND_24V: C44.2 DA8.1(-Vin) ; port GND_24V
INT_DIG_MOD: DA7.3(B1) ; port INT_DIG_MOD
ON/OFF: DD4.3(VIA) ; port ON/OFF
OVERCUR: DD5.7(VOA) ; port OVERCUR
OVERHEAT: DD5.6(VOB) ; port OVERHEAT
SELECT_MOD: DA7.6(S) ; port SELECT_MOD
NetC52_1: C52.1 DA10.3(IN+) R28.2
NetDA7_4: DA7.4(A) DD4.4(VIB)
NetDA10_1: DA10.1(OUT) DA10.4(IN-) XP7.5
NetDD4_12: DD4.12(VOC) R28.1
NetDD4_13: DD4.13(VOB) XP7.4
NetDD4_14: DD4.14(VOA) XP7.3
NetDD5_2: DD5.2(VIA) R29.2 XP7.6
NetDD5_3: DD5.3(VIB) R30.2 XP7.7

Not connected (* = marked no-connect by the designer): DD4 7(NC) 11(VOD); XP7 8

### Channels
A13: designators end in A13; ports +3.3V=+3.3V +24V=+24V AN_MOD=DRV1_AN_MOD EXT_DIG_MOD=EXT_DIG_MOD GND=GND GND_24V=GND_24V INT_DIG_MOD=DRV1_DIG_MOD ON/OFF=DRV1_ON OVERCUR=DRV1_ERR1 OVERHEAT=DRV1_ERR2 SELECT_MOD=DRV1_SEL_MOD
A14: designators end in A14; ports +3.3V=+3.3V +24V=+24V AN_MOD=DRV2_AN_MOD EXT_DIG_MOD=EXT_DIG_MOD GND=GND GND_24V=GND_24V INT_DIG_MOD=DRV2_DIG_MOD ON/OFF=DRV2_ON OVERCUR=DRV2_ERR1 OVERHEAT=DRV2_ERR2 SELECT_MOD=DRV2_SEL_MOD
A15: designators end in A15; ports +3.3V=+3.3V +24V=+24V AN_MOD=DRV3_AN_MOD EXT_DIG_MOD=EXT_DIG_MOD GND=GND GND_24V=GND_24V INT_DIG_MOD=DRV3_DIG_MOD ON/OFF=DRV3_ON OVERCUR=DRV3_ERR1 OVERHEAT=DRV3_ERR2 SELECT_MOD=DRV3_SEL_MOD
A16: designators end in A16; ports +3.3V=+3.3V +24V=+24V AN_MOD=DRV4_AN_MOD EXT_DIG_MOD=EXT_DIG_MOD GND=GND GND_24V=GND_24V INT_DIG_MOD=DRV4_DIG_MOD ON/OFF=DRV4_ON OVERCUR=DRV4_ERR1 OVERHEAT=DRV4_ERR2 SELECT_MOD=DRV4_SEL_MOD

### Notes on the sheet
- +12V
- ON/OFF
- DIG_MOD
- GND
- AN_MOD
- OVERCURRENT
- OVERHEAT
- Подп. и дата
- Инв. № дубл.
- Взам. инв. №
- Инв. № подл.
- Изм.
- Лист
- № докум.
- Подп.
- Дата
- Копировал
- Формат А3
- (in symbol Connector-8) Конт.; Цепь
- (in symbol LD2981ABU50TR) *STU
- (in symbol TME) DC/DC

### Library data of the parts
C44 = Capacitor_Polar: Model: TECAP, 10 мкФ, 35 В, тип C, 10%; Value: 10мкФх35B; Document: *; Manufacturer: *
C45-C47 C49 C50 C53 C54 = Capacitor: as C3 on sheet Main; Value: 0,1мкФ; Document: *
C48 = Capacitor_Polar: Model: TECAP, 10 мкФ, 25 В, тип B, 10%; Value: 10мкФх25B; Document: *; Manufacturer: *
C51 = Capacitor: Manufacturer: Murata; Model: GRM219R71H334KA88D; Value: 0,33мкФ; Document: *
C52 = Capacitor: as C34 on sheet Photodiode; Value: 10нФ; Document: *
DA7 = SN74LVC1G3157: Manufacturer: Texas Instruments; Model: SN74LVC1G3157DBV; Document: *
DA8 = TME: Manufacturer: Traco Power; Model: TME 2412S; Document: *
DA9 = LD2981ABU50TR: Manufacturer: STMicroelectronics; Model: L78L05ABUTR; Document: *
DA10 = LMC7101: Manufacturer: Texas Instruments; Model: LMC7101BIM5; Document: *
DD4 = ADUM1400: Manufacturer: Analog Devices; Model: ADUM1400CRW; Document: *
DD5 = ADUM1200: Manufacturer: Analog Devices; Model: ADUM1200CR; Document: *
R28-R30 = Resistor: as R3 on sheet Main; Value: 10к; Document: *
XP7 = Connector-8: Manufacturer: JST; Model: B8B-PHDSS; Document: *

## Sheet Power_supply_CAN.SchDoc
size 420 x 297 mm; Address1: Address1; Address2: Address2; Address3: Address3; Address4: Address4; DocumentNumber: *Э3; SheetNumber: 7; SheetTotal: 15; DocumentType: Схема электрическая *
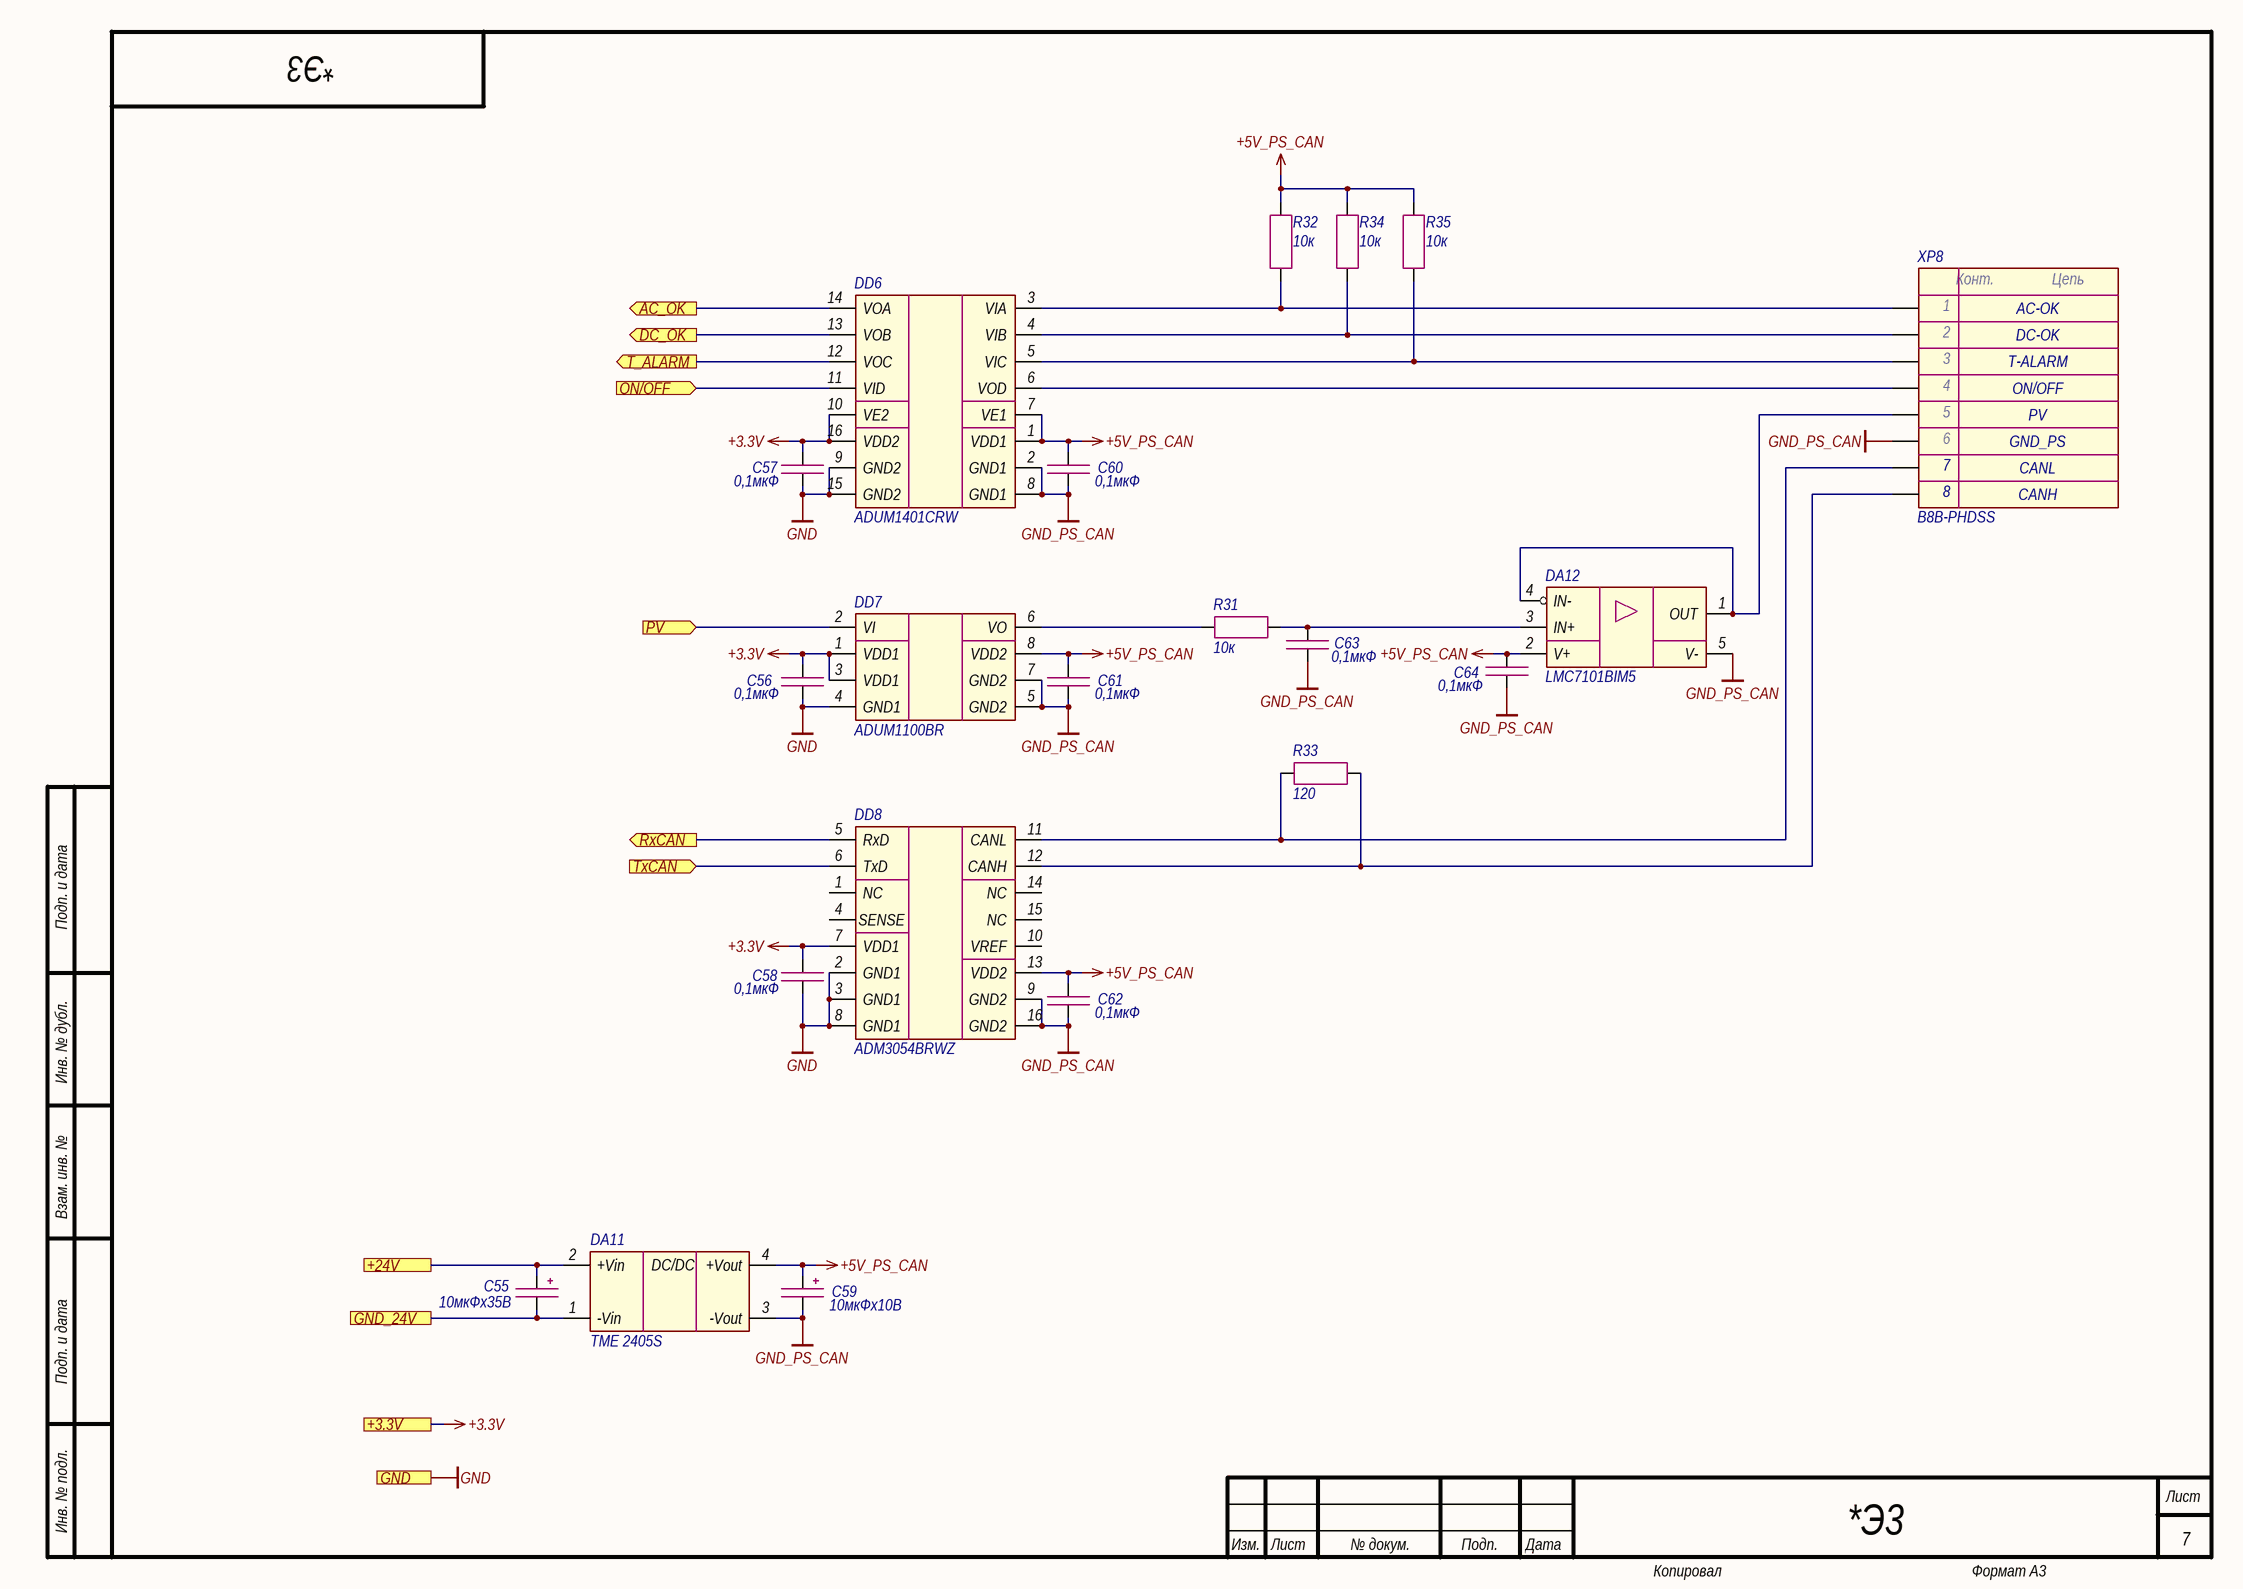
[diagram p5: Power_supply_CAN.SchDoc]

### Parts
C55  10мкФх35B  [CAP_C]
C56  0,1мкФ  [CAP_0603]
C57  0,1мкФ  [CAP_0603]
C58  0,1мкФ  [CAP_0603]
C59  10мкФх10B  [CAP_A]
C60  0,1мкФ  [CAP_0603]
C61  0,1мкФ  [CAP_0603]
C62  0,1мкФ  [CAP_0603]
C63  0,1мкФ  [CAP_0603]
C64  0,1мкФ  [CAP_0603]
DA11  TME 2405S  [TME (SIP-4)]
DA12  LMC7101BIM5  [SOT-23-5]
DD6  ADUM1401CRW  [SOIC-16W]
DD7  ADUM1100BR  [SOIC-8]
DD8  ADM3054BRWZ  [SOIC-16W]
R31  10к  [RES_0603]
R32  10к  [RES_0603]
R33  120  [RES_0805]
R34  10к  [RES_0603]
R35  10к  [RES_0603]
XP8  B8B-PHDSS  [B8B-PHDSS]

### Ports
+3.3V (see Main[2B], Button[1D], Ethernet[3D], Fiber_interlock[2C], Flow_sensor[2C], Hardwiring[3D], LD_driver[1D], Power_supply[1D], SF_driver[2C]), +24V (see Main[2C], Button[1C], Column[1C], Flow_sensor[2C], Hardwiring[3C], Indication[1C], LD_driver[1C], Power_supply[1D]), AC_OK (out, see Main[2B]), DC_OK (out, see Main[2B]), GND (see Main[2C], Button[1D], Column[1C], Ethernet[3D], Fiber_interlock[2C], Flow_sensor[2C], Guide_laser[1C], Hardwiring[3D], Indication[1C], LD_driver[1D], Power_supply[1D], SF_driver[2D]), GND_24V (see Main[2C], Button[1D], Column[1C], Flow_sensor[2C], Hardwiring[3C], Indication[1C], LD_driver[1D], Power_supply[1D]), ON/OFF (in, see Main[2B]), PV (in, see Main[2B]), RxCAN (out, see Main[2C]), T_ALARM (out, see Main[2B]), TxCAN (in, see Main[2C])

### Nets
+3.3V: C56.1 C57.1 C58.1 DD6.10(VE2) DD6.16(VDD2) DD7.1(VDD1) DD7.3(VDD1) DD8.7(VDD1) ; port +3.3V
+5V_PS_CAN: C59.1 C60.1 C61.1 C62.1 C64.1 DA11.4(+Vout) DA12.2(V+) DD6.1(VDD1) DD6.7(VE1) DD7.8(VDD2) DD8.13(VDD2) R32.1 R34.1 R35.1
+24V: C55.1 DA11.2(+Vin) ; port +24V
GND: C56.2 C57.2 C58.2 DD6.9(GND2) DD6.15(GND2) DD7.4(GND1) DD8.2(GND1) DD8.3(GND1) DD8.8(GND1) ; port GND
GND_24V: C55.2 DA11.1(-Vin) ; port GND_24V
GND_PS_CAN: C59.2 C60.2 C61.2 C62.2 C63.2 C64.2 DA11.3(-Vout) DA12.5(V-) DD6.2(GND1) DD6.8(GND1) DD7.5(GND2) DD7.7(GND2) DD8.9(GND2) DD8.16(GND2) XP8.6
PS1_ERR1: DD6.14(VOA) ; port AC_OK
PS1_ERR2: DD6.13(VOB) ; port DC_OK
PS1_ERR3: DD6.12(VOC) ; port T_ALARM
PS1_ON: DD6.11(VID) ; port ON/OFF
PS1_PV: DD7.2(VI) ; port PV
RxCAN: DD8.5(RxD) ; port RxCAN
TxCAN: DD8.6(TxD) ; port TxCAN
NetC63_1: C63.1 DA12.3(IN+) R31.2
NetDA12_1: DA12.1(OUT) DA12.4(IN-) XP8.5
NetDD6_3: DD6.3(VIA) R32.2 XP8.1
NetDD6_4: DD6.4(VIB) R34.2 XP8.2
NetDD6_5: DD6.5(VIC) R35.2 XP8.3
NetDD6_6: DD6.6(VOD) XP8.4
NetDD7_6: DD7.6(VO) R31.1
NetDD8_11: DD8.11(CANL) R33.1 XP8.7
NetDD8_12: DD8.12(CANH) R33.2 XP8.8

Not connected (* = marked no-connect by the designer): DD8 1(NC) 4(SENSE) 10(VREF) 14(NC) 15(NC)

### Notes on the sheet
- AC-OK
- DC-OK
- T-ALARM
- ON/OFF
- CANL
- GND_PS
- PV
- CANH
- Подп. и дата
- Инв. № дубл.
- Взам. инв. №
- Инв. № подл.
- Изм.
- Лист
- № докум.
- Подп.
- Дата
- Копировал
- Формат А3
- (in symbol Connector-8) Конт.; Цепь
- (in symbol TME) DC/DC

### Library data of the parts
C55 = Capacitor_Polar: Model: TECAP, 10 мкФ, 35 В, тип C, 10%; Value: 10мкФх35B; Document: *; Manufacturer: *
C56-C58 C60-C64 = Capacitor: as C3 on sheet Main; Value: 0,1мкФ; Document: *
C59 = Capacitor_Polar: Model: TECAP, 10 мкФ, 10 В, тип A, 10%; Value: 10мкФх10B; Document: *; Manufacturer: *
DA11 = TME: Manufacturer: Traco Power; Model: TME 2405S; Document: *
DA12 = LMC7101: Manufacturer: Texas Instruments; Model: LMC7101BIM5; Document: *
DD6 = ADUM1401: Manufacturer: Analog Devices; Model: ADUM1401CRW; Document: *
DD7 = ADUM1100: Manufacturer: Analog Devices; Model: ADUM1100BR; Document: *
DD8 = ADM3054BRWZ: Manufacturer: Analog Devices; Model: ADM3054BRWZ; Document: *
R31 R32 R34 R35 = Resistor: as R3 on sheet Main; Value: 10к; Document: *
R33 = Resistor: Manufacturer: Yageo; Model: RC0805FR-07120RL; Value: 120; Document: *
XP8 = Connector-8: Manufacturer: JST; Model: B8B-PHDSS; Document: *

## Sheet Power_supply.SchDoc
size 420 x 297 mm; Address1: Address1; Address2: Address2; Address3: Address3; Address4: Address4; DocumentNumber: *Э3; SheetNumber: 8; SheetTotal: 15; DocumentType: Схема электрическая *
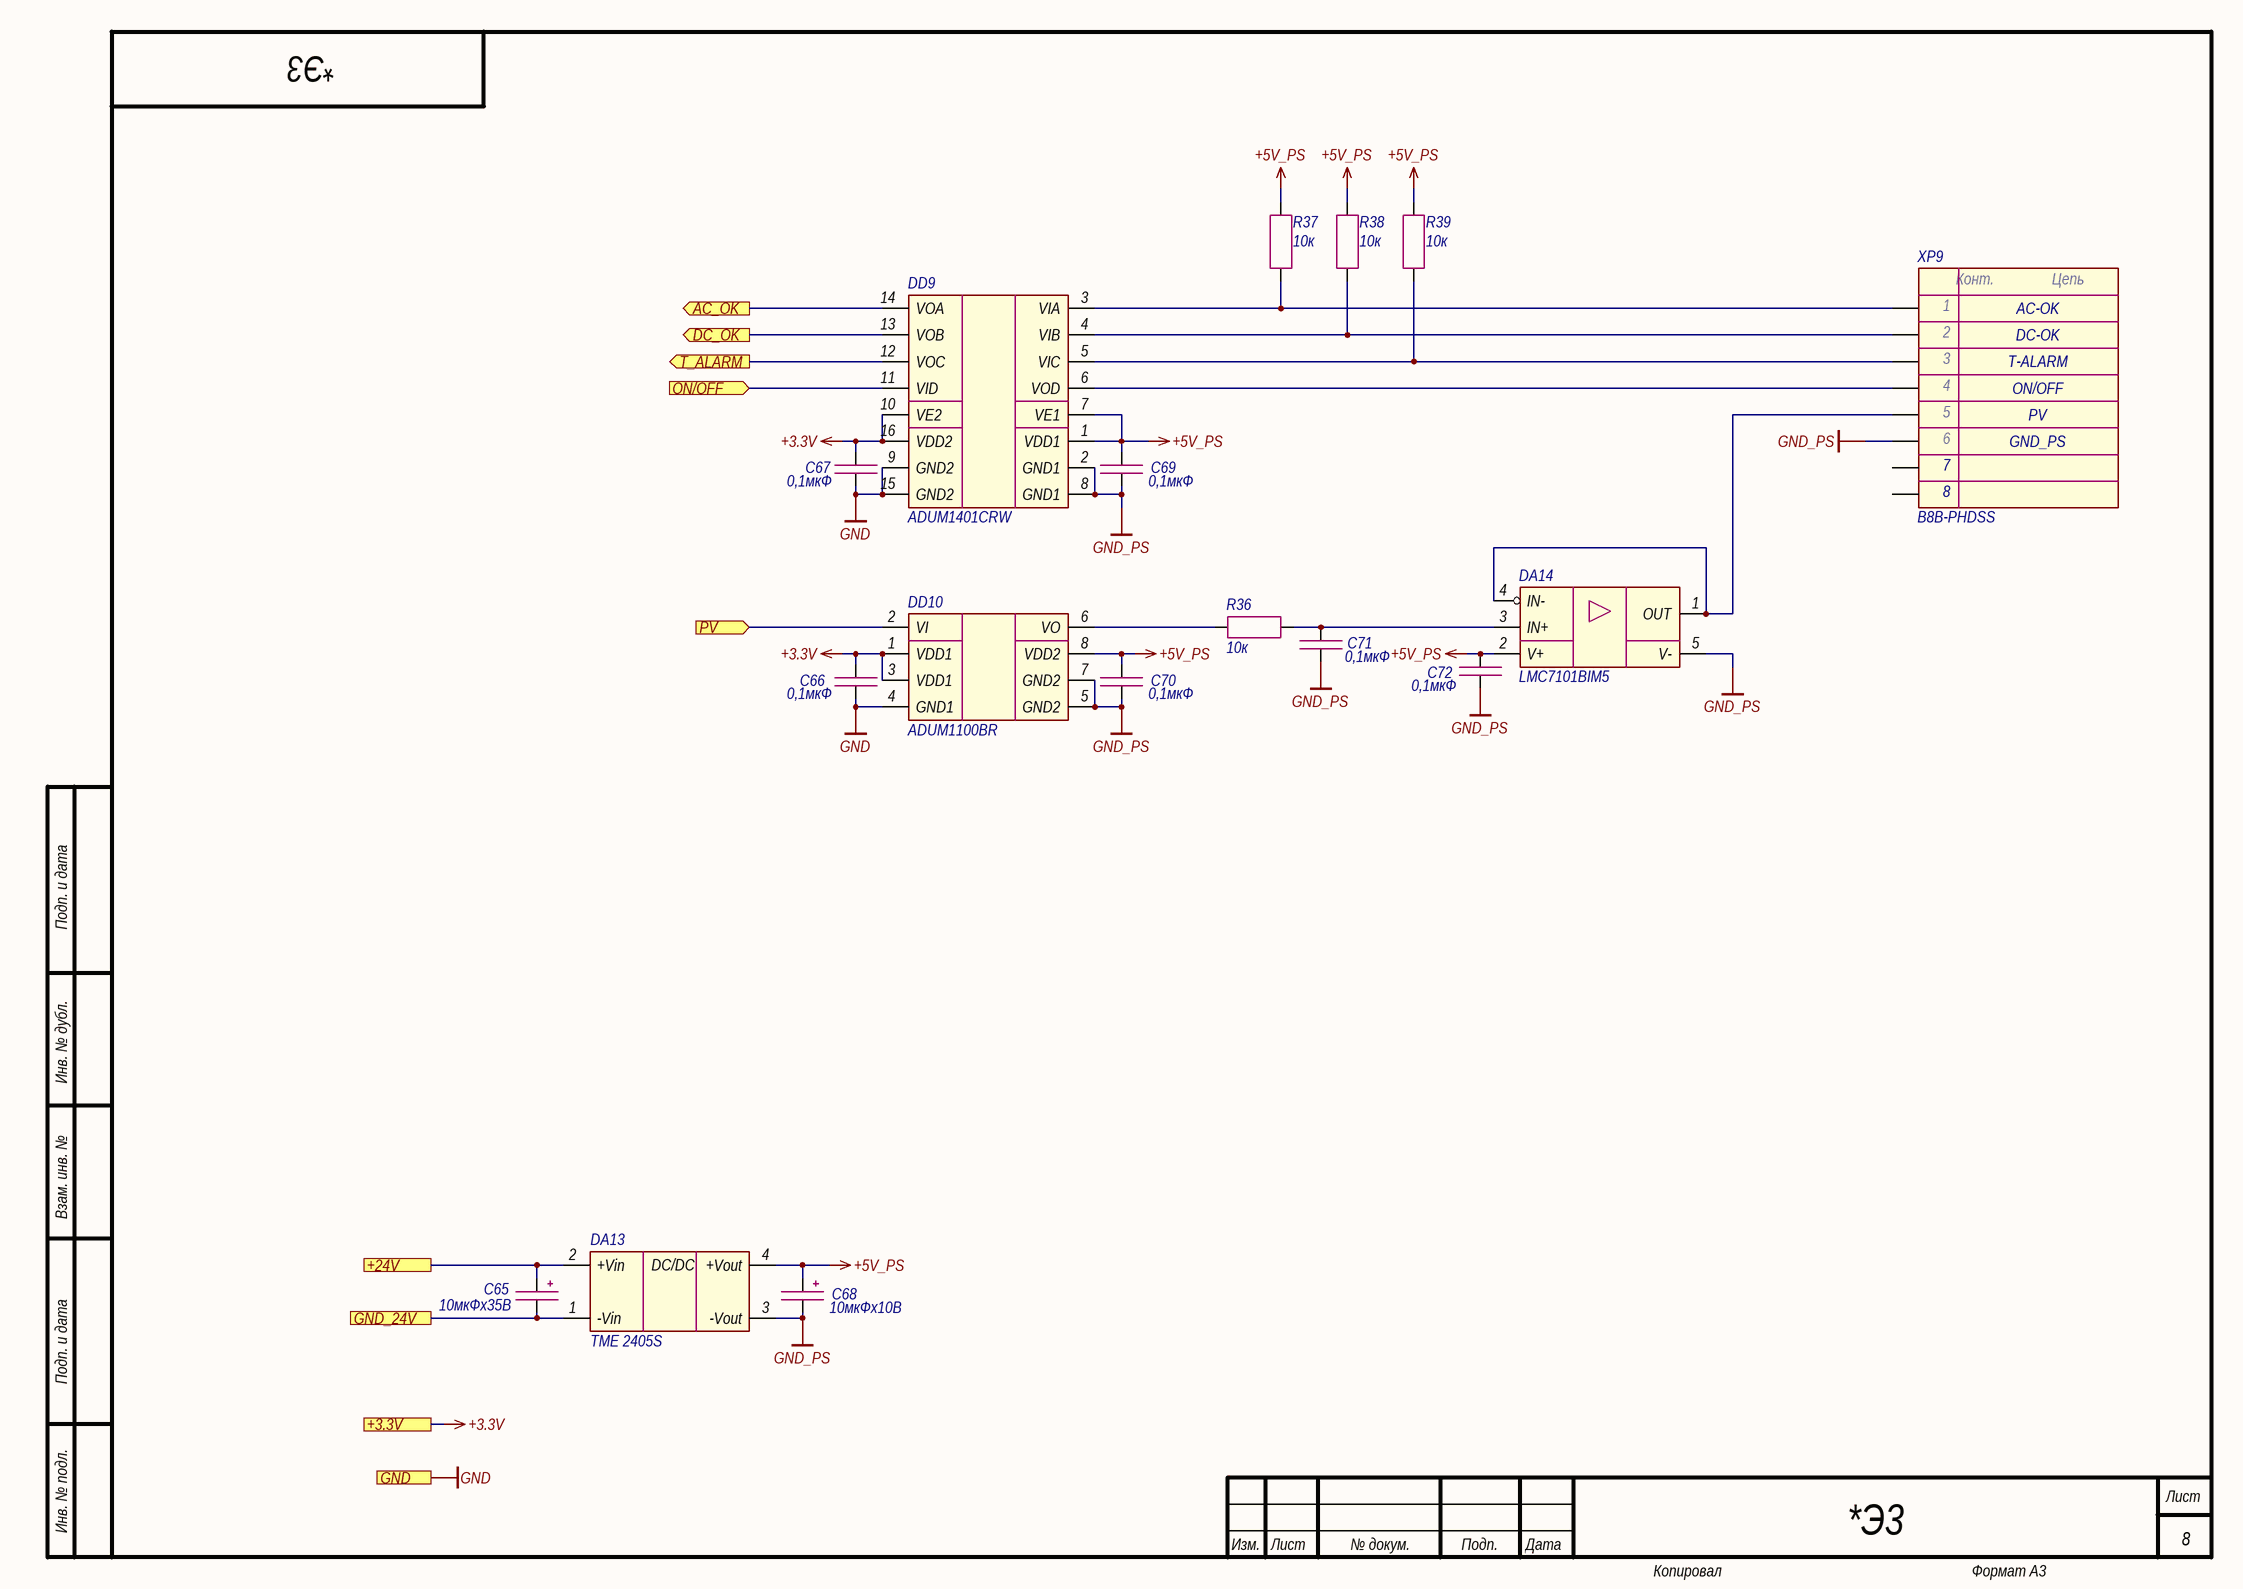
[diagram p6: Power_supply.SchDoc]

### Parts
C65  10мкФх35B  [CAP_C]
C66  0,1мкФ  [CAP_0603]
C67  0,1мкФ  [CAP_0603]
C68  10мкФх10B  [CAP_A]
C69  0,1мкФ  [CAP_0603]
C70  0,1мкФ  [CAP_0603]
C71  0,1мкФ  [CAP_0603]
C72  0,1мкФ  [CAP_0603]
DA13  TME 2405S  [TME (SIP-4)]
DA14  LMC7101BIM5  [SOT-23-5]
DD9  ADUM1401CRW  [SOIC-16W]
DD10  ADUM1100BR  [SOIC-8]
R36  10к  [RES_0603]
R37  10к  [RES_0603]
R38  10к  [RES_0603]
R39  10к  [RES_0603]
XP9  B8B-PHDSS  [B8B-PHDSS]

### Ports
+3.3V (see Main[2C], Button[1D], Ethernet[3D], Fiber_interlock[2C], Flow_sensor[2C], Hardwiring[3D], LD_driver[1D], Power_supply_CAN[1D], SF_driver[2C]), +24V (see Main[2C], Button[1C], Column[1C], Flow_sensor[2C], Hardwiring[3C], Indication[1C], LD_driver[1C], Power_supply_CAN[1D]), AC_OK (out, see Main[2C]), DC_OK (out, see Main[2C]), GND (see Main[2C], Button[1D], Column[1C], Ethernet[3D], Fiber_interlock[2C], Flow_sensor[2C], Guide_laser[1C], Hardwiring[3D], Indication[1C], LD_driver[1D], Power_supply_CAN[1D], SF_driver[2D]), GND_24V (see Main[2C], Button[1D], Column[1C], Flow_sensor[2C], Hardwiring[3C], Indication[1C], LD_driver[1D], Power_supply_CAN[1D]), ON/OFF (in, see Main[2C]), PV (in, see Main[2C]), T_ALARM (out, see Main[2C])

### Nets
+3.3V: C66.1 C67.1 DD9.10(VE2) DD9.16(VDD2) DD10.1(VDD1) DD10.3(VDD1) ; port +3.3V
+5V_PS: C68.1 C69.1 C70.1 C72.1 DA13.4(+Vout) DA14.2(V+) DD9.1(VDD1) DD9.7(VE1) DD10.8(VDD2) R37.1 R38.1 R39.1
+24V: C65.1 DA13.2(+Vin) ; port +24V
GND: C66.2 C67.2 DD9.9(GND2) DD9.15(GND2) DD10.4(GND1) ; port GND
GND_24V: C65.2 DA13.1(-Vin) ; port GND_24V
GND_PS: C68.2 C69.2 C70.2 C71.2 C72.2 DA13.3(-Vout) DA14.5(V-) DD9.2(GND1) DD9.8(GND1) DD10.5(GND2) DD10.7(GND2) XP9.6
PS2_ERR1: DD9.14(VOA) ; port AC_OK
PS2_ERR2: DD9.13(VOB) ; port DC_OK
PS2_ERR3: DD9.12(VOC) ; port T_ALARM
PS2_ON: DD9.11(VID) ; port ON/OFF
PS2_PV: DD10.2(VI) ; port PV
NetC71_1: C71.1 DA14.3(IN+) R36.2
NetDA14_1: DA14.1(OUT) DA14.4(IN-) XP9.5
NetDD9_3: DD9.3(VIA) R37.2 XP9.1
NetDD9_4: DD9.4(VIB) R38.2 XP9.2
NetDD9_5: DD9.5(VIC) R39.2 XP9.3
NetDD9_6: DD9.6(VOD) XP9.4
NetDD10_6: DD10.6(VO) R36.1

Not connected (* = marked no-connect by the designer): XP9 7 8

### Notes on the sheet
- AC-OK
- DC-OK
- T-ALARM
- ON/OFF
- GND_PS
- PV
- Подп. и дата
- Инв. № дубл.
- Взам. инв. №
- Инв. № подл.
- Изм.
- Лист
- № докум.
- Подп.
- Дата
- Копировал
- Формат А3
- (in symbol Connector-8) Конт.; Цепь
- (in symbol TME) DC/DC

### Library data of the parts
C65 = Capacitor_Polar: Model: TECAP, 10 мкФ, 35 В, тип C, 10%; Value: 10мкФх35B; Document: *; Manufacturer: *
C66 C67 C69-C72 = Capacitor: as C3 on sheet Main; Value: 0,1мкФ; Document: *
C68 = Capacitor_Polar: Model: TECAP, 10 мкФ, 10 В, тип A, 10%; Value: 10мкФх10B; Document: *; Manufacturer: *
DA13 = TME: Manufacturer: Traco Power; Model: TME 2405S; Document: *
DA14 = LMC7101: Manufacturer: Texas Instruments; Model: LMC7101BIM5; Document: *
DD9 = ADUM1401: Manufacturer: Analog Devices; Model: ADUM1401CRW; Document: *
DD10 = ADUM1100: Manufacturer: Analog Devices; Model: ADUM1100BR; Document: *
R36-R39 = Resistor: as R3 on sheet Main; Value: 10к; Document: *
XP9 = Connector-8: Manufacturer: JST; Model: B8B-PHDSS; Document: *

## Sheet Fiber_interlock.SchDoc
size 420 x 297 mm; Address1: Address1; Address2: Address2; Address3: Address3; Address4: Address4; DocumentNumber: *Э3; SheetNumber: 5; SheetTotal: 15; DocumentType: Схема электрическая *
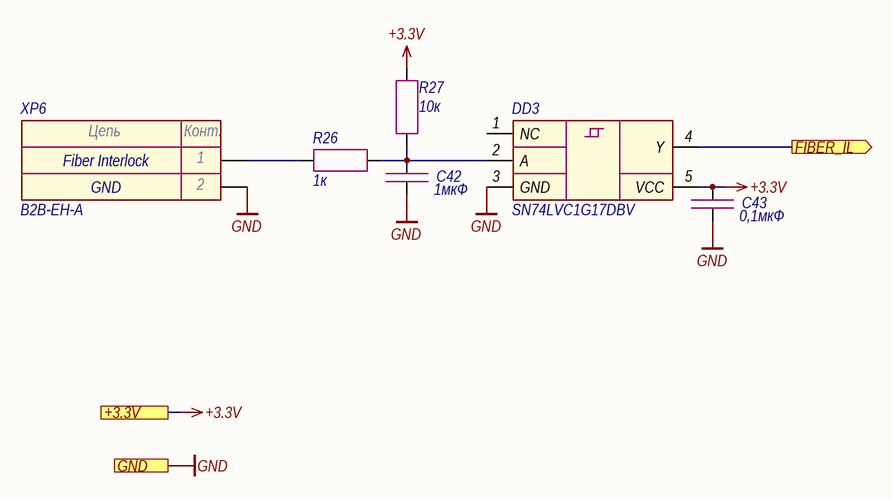
[diagram p7: Fiber_interlock.SchDoc]

### Parts
C42  1мкФ  [CAP_0603]
C43  0,1мкФ  [CAP_0603]
DD3  SN74LVC1G17DBV  [SOT-23-5]
R26  1к  [RES_0603]
R27  10к  [RES_0603]
XP6  B2B-EH-A  [B2B-EH-A]

### Ports
+3.3V (see Main[1C], Button[1D], Ethernet[3D], Flow_sensor[2C], Hardwiring[3D], LD_driver[1D], Power_supply[1D], Power_supply_CAN[1D], SF_driver[2C]), FIBER_IL (out, see Main[2C]), GND (see Main[1C], Button[1D], Column[1C], Ethernet[3D], Flow_sensor[2C], Guide_laser[1C], Hardwiring[3D], Indication[1C], LD_driver[1D], Power_supply[1D], Power_supply_CAN[1D], SF_driver[2D])

### Nets
+3.3V: C43.1 DD3.5(VCC) R27.2 ; port +3.3V
GND: C42.2 C43.2 DD3.3(GND) XP6.2 ; port GND
FIBER_IL: DD3.4(Y) ; port FIBER_IL
NetC42_1: C42.1 DD3.2(A) R26.2 R27.1
NetR26_1: R26.1 XP6.1

Not connected (* = marked no-connect by the designer): DD3 1(NC)

### Notes on the sheet
- (near XP6) Fiber Interlock
- GND
- Подп. и дата
- Инв. № дубл.
- Взам. инв. №
- Инв. № подл.
- Изм.
- Лист
- № докум.
- Подп.
- Дата
- Копировал
- Формат А3
- (in symbol Connector-2) Цепь; Конт.

### Library data of the parts
C42 = Capacitor: Manufacturer: Murata; Model: GRM188R61H105KAALD; Value: 1мкФ; Document: *
C43 = Capacitor: as C3 on sheet Main; Value: 0,1мкФ; Document: *
DD3 = SN74LVC1G17: Manufacturer: Texas Instruments; Model: SN74LVC1G17DBV; Document: *
R26 = Resistor: Manufacturer: Yageo; Model: RC0603FR-071KL; Value: 1к; Document: *
R27 = Resistor: as R3 on sheet Main; Value: 10к; Document: *
XP6 = Connector-2: Manufacturer: JST; Model: B2B-EH-A; Document: *

## Sheet Button.SchDoc
size 420 x 297 mm; Address1: Address1; Address2: Address2; Address3: Address3; Address4: Address4; DocumentNumber: *Э3; SheetNumber: 9; SheetTotal: 15; DocumentType: Схема электрическая *
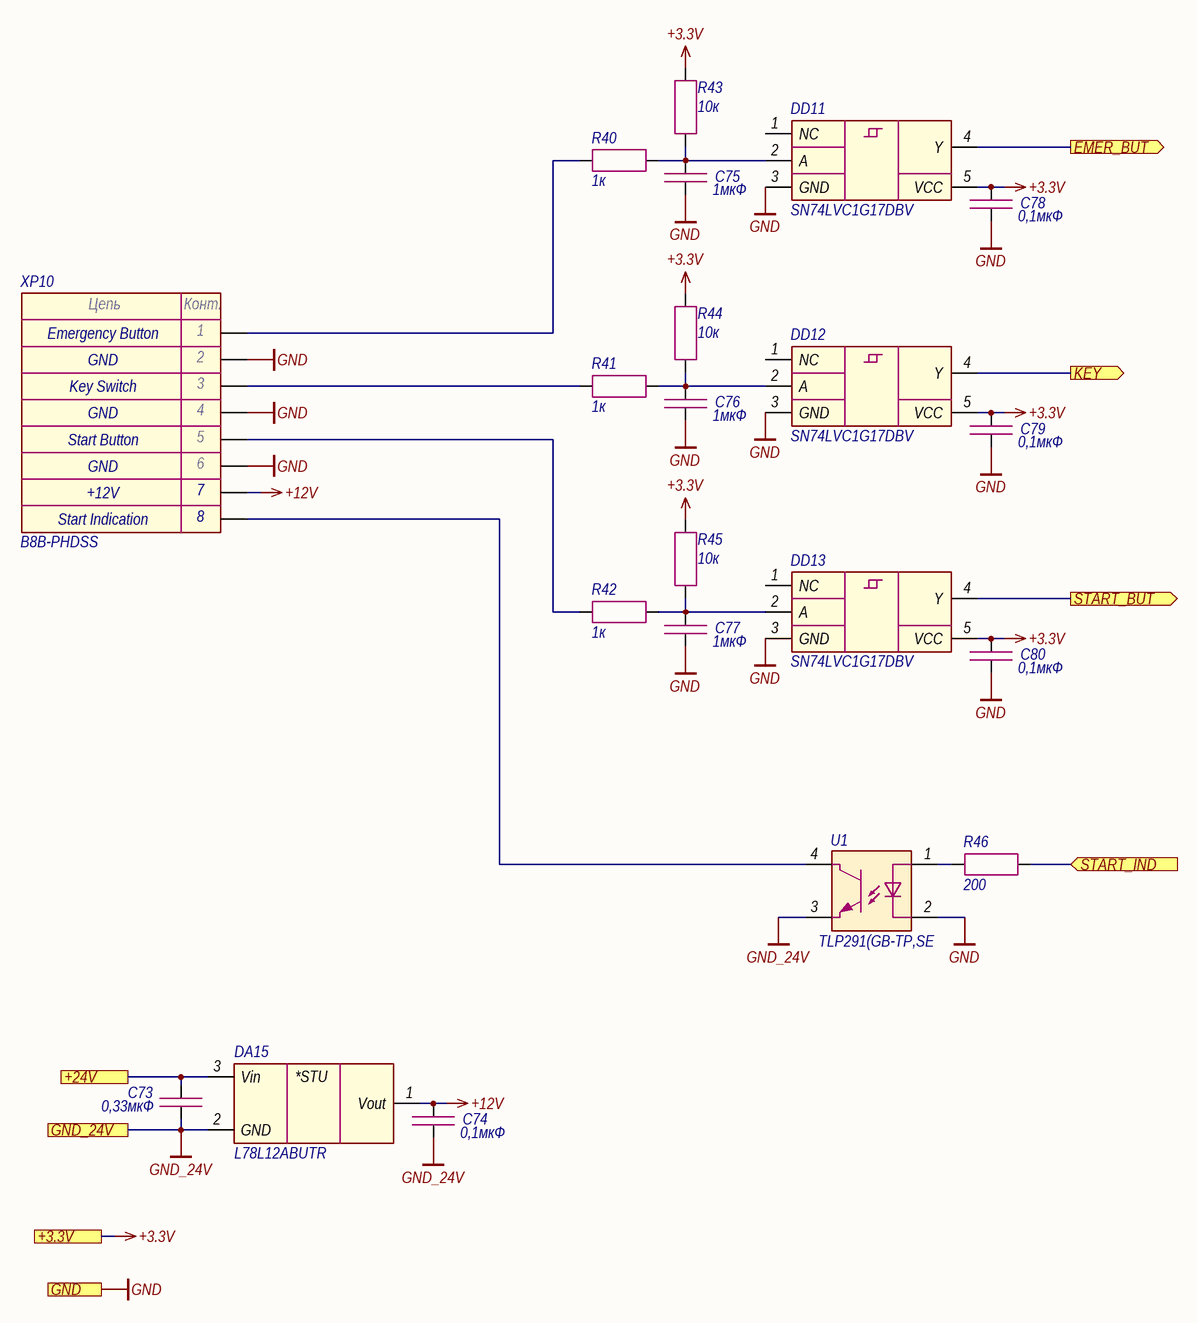
[diagram p8: Button.SchDoc]

### Parts
C73  0,33мкФ  [CAP_0805]
C74  0,1мкФ  [CAP_0603]
C75  1мкФ  [CAP_0603]
C76  1мкФ  [CAP_0603]
C77  1мкФ  [CAP_0603]
C78  0,1мкФ  [CAP_0603]
C79  0,1мкФ  [CAP_0603]
C80  0,1мкФ  [CAP_0603]
DA15  L78L12ABUTR  [SOT-89]
DD11  SN74LVC1G17DBV  [SOT-23-5]
DD12  SN74LVC1G17DBV  [SOT-23-5]
DD13  SN74LVC1G17DBV  [SOT-23-5]
R40  1к  [RES_0603]
R41  1к  [RES_0603]
R42  1к  [RES_0603]
R43  10к  [RES_0603]
R44  10к  [RES_0603]
R45  10к  [RES_0603]
R46  200  [RES_0603]
U1  TLP291(GB-TP,SE  [11-3C1]
XP10  B8B-PHDSS  [B8B-PHDSS]

### Ports
+3.3V (see Main[2C], Ethernet[3D], Fiber_interlock[2C], Flow_sensor[2C], Hardwiring[3D], LD_driver[1D], Power_supply[1D], Power_supply_CAN[1D], SF_driver[2C]), +24V (see Main[2C], Column[1C], Flow_sensor[2C], Hardwiring[3C], Indication[1C], LD_driver[1C], Power_supply[1D], Power_supply_CAN[1D]), EMER_BUT (out, see Main[2C]), GND (see Main[2C], Column[1C], Ethernet[3D], Fiber_interlock[2C], Flow_sensor[2C], Guide_laser[1C], Hardwiring[3D], Indication[1C], LD_driver[1D], Power_supply[1D], Power_supply_CAN[1D], SF_driver[2D]), GND_24V (see Main[2C], Column[1C], Flow_sensor[2C], Hardwiring[3C], Indication[1C], LD_driver[1D], Power_supply[1D], Power_supply_CAN[1D]), KEY (out, see Main[2C]), START_BUT (out, see Main[2C]), START_IND (in, see Main[2C])

### Nets
+3.3V: C78.1 C79.1 C80.1 DD11.5(VCC) DD12.5(VCC) DD13.5(VCC) R43.2 R44.2 R45.2 ; port +3.3V
+12V: C74.1 DA15.1(Vout) XP10.7
+24V: C73.2 DA15.3(Vin) ; port +24V
GND: C75.2 C76.2 C77.2 C78.2 C79.2 C80.2 DD11.3(GND) DD12.3(GND) DD13.3(GND) U1.2 XP10.2 XP10.4 XP10.6 ; port GND
GND_24V: C73.1 C74.2 DA15.2(GND) U1.3 ; port GND_24V
EMER_BUT: DD11.4(Y) ; port EMER_BUT
KEY: DD12.4(Y) ; port KEY
START_BUT: DD13.4(Y) ; port START_BUT
START_IND: R46.2 ; port START_IND
NetC75_1: C75.1 DD11.2(A) R40.2 R43.1
NetC76_1: C76.1 DD12.2(A) R41.2 R44.1
NetC77_1: C77.1 DD13.2(A) R42.2 R45.1
NetR40_1: R40.1 XP10.1
NetR41_1: R41.1 XP10.3
NetR42_1: R42.1 XP10.5
NetR46_1: R46.1 U1.1
NetU1_4: U1.4 XP10.8

Not connected (* = marked no-connect by the designer): DD11 1(NC); DD12 1(NC); DD13 1(NC)

### Notes on the sheet
- GND
- (near XP10) Emergency Button
- Start Button
- Key Switch
- +12V
- (near XP10) Start Indication
- Подп. и дата
- Инв. № дубл.
- Взам. инв. №
- Инв. № подл.
- Изм.
- Лист
- № докум.
- Подп.
- Дата
- Копировал
- Формат А3
- (in symbol Connector-8) Цепь; Конт.
- (in symbol LD2981ABU50TR) *STU

### Library data of the parts
C73 = Capacitor: as C51 on sheet LD_driver; Value: 0,33мкФ; Document: *
C74 C78-C80 = Capacitor: as C3 on sheet Main; Value: 0,1мкФ; Document: *
C75-C77 = Capacitor: as C42 on sheet Fiber_interlock; Value: 1мкФ; Document: *
DA15 = LD2981ABU50TR: Manufacturer: STMicroelectronics; Model: L78L12ABUTR; Document: *
DD11-DD13 = SN74LVC1G17: Manufacturer: Texas Instruments; Model: SN74LVC1G17DBV; Document: *
R40-R42 = Resistor: as R26 on sheet Fiber_interlock; Value: 1к; Document: *
R43-R45 = Resistor: as R3 on sheet Main; Value: 10к; Document: *
R46 = Resistor: as R4 on sheet Main; Value: 200; Document: *
U1 = TLP291: Manufacturer: Toshiba; Model: TLP291(GB-TP,SE; Document: *
XP10 = Connector-8: Manufacturer: JST; Model: B8B-PHDSS; Document: *

## Sheet Indication.SchDoc
size 420 x 297 mm; Address1: Address1; Address2: Address2; Address3: Address3; Address4: Address4; DocumentNumber: *Э3; SheetNumber: 10; SheetTotal: 15; DocumentType: Схема электрическая *
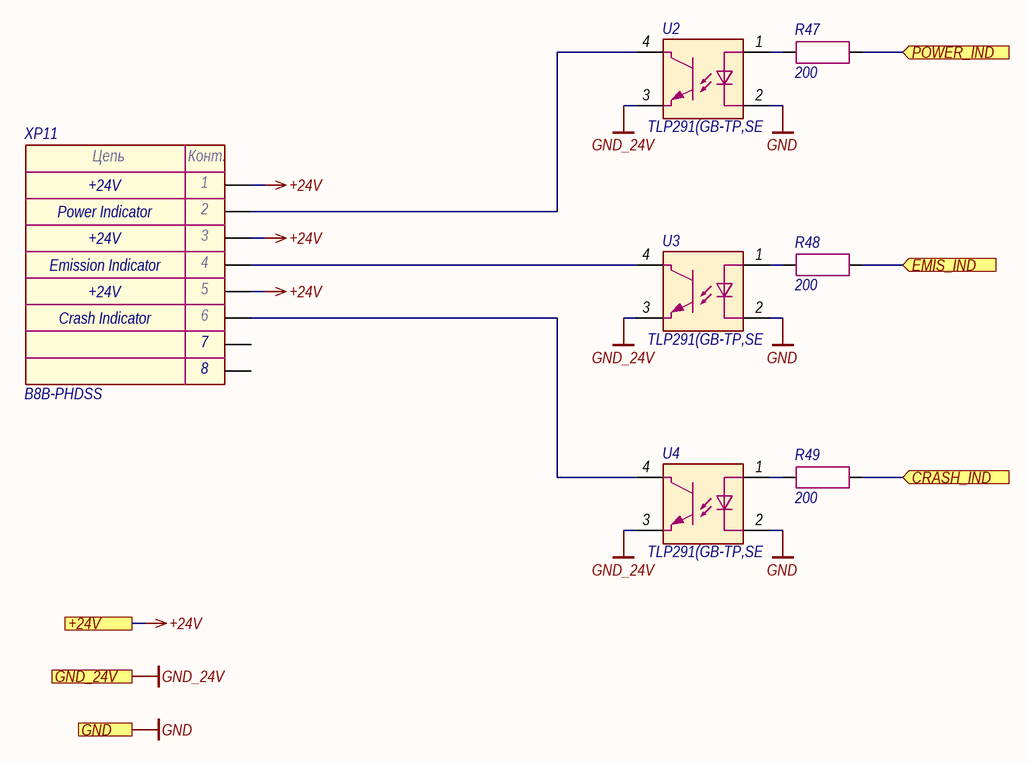
[diagram p9: Indication.SchDoc]

### Parts
R47  200  [RES_0603]
R48  200  [RES_0603]
R49  200  [RES_0603]
U2  TLP291(GB-TP,SE  [11-3C1]
U3  TLP291(GB-TP,SE  [11-3C1]
U4  TLP291(GB-TP,SE  [11-3C1]
XP11  B8B-PHDSS  [B8B-PHDSS]

### Ports
+24V (see Main[2C], Button[1C], Column[1C], Flow_sensor[2C], Hardwiring[3C], LD_driver[1C], Power_supply[1D], Power_supply_CAN[1D]), CRASH_IND (in, see Main[2D]), EMIS_IND (in, see Main[2C]), GND (see Main[2D], Button[1D], Column[1C], Ethernet[3D], Fiber_interlock[2C], Flow_sensor[2C], Guide_laser[1C], Hardwiring[3D], LD_driver[1D], Power_supply[1D], Power_supply_CAN[1D], SF_driver[2D]), GND_24V (see Main[2C], Button[1D], Column[1C], Flow_sensor[2C], Hardwiring[3C], LD_driver[1D], Power_supply[1D], Power_supply_CAN[1D]), POWER_IND (in, see Main[2C])

### Nets
+24V: XP11.1 XP11.3 XP11.5 ; port +24V
GND: U2.2 U3.2 U4.2 ; port GND
GND_24V: U2.3 U3.3 U4.3 ; port GND_24V
CRASH_IND: R49.2 ; port CRASH_IND
EMIS_IND: R48.2 ; port EMIS_IND
POWER_IND: R47.2 ; port POWER_IND
NetR47_1: R47.1 U2.1
NetR48_1: R48.1 U3.1
NetR49_1: R49.1 U4.1
NetU2_4: U2.4 XP11.2
NetU3_4: U3.4 XP11.4
NetU4_4: U4.4 XP11.6

Not connected (* = marked no-connect by the designer): XP11 7 8

### Notes on the sheet
- Power Indicator
- +24V
- (near XP11) Emission Indicator
- Crash Indicator
- Подп. и дата
- Инв. № дубл.
- Взам. инв. №
- Инв. № подл.
- Изм.
- Лист
- № докум.
- Подп.
- Дата
- Копировал
- Формат А3
- (in symbol Connector-8) Цепь; Конт.

### Library data of the parts
R47-R49 = Resistor: as R4 on sheet Main; Value: 200; Document: *
U2-U4 = TLP291: Manufacturer: Toshiba; Model: TLP291(GB-TP,SE; Document: *
XP11 = Connector-8: Manufacturer: JST; Model: B8B-PHDSS; Document: *

## Sheet Column.SchDoc
size 420 x 297 mm; Address1: Address1; Address2: Address2; Address3: Address3; Address4: Address4; DocumentNumber: *Э3; SheetNumber: 11; SheetTotal: 15; DocumentType: Схема электрическая *
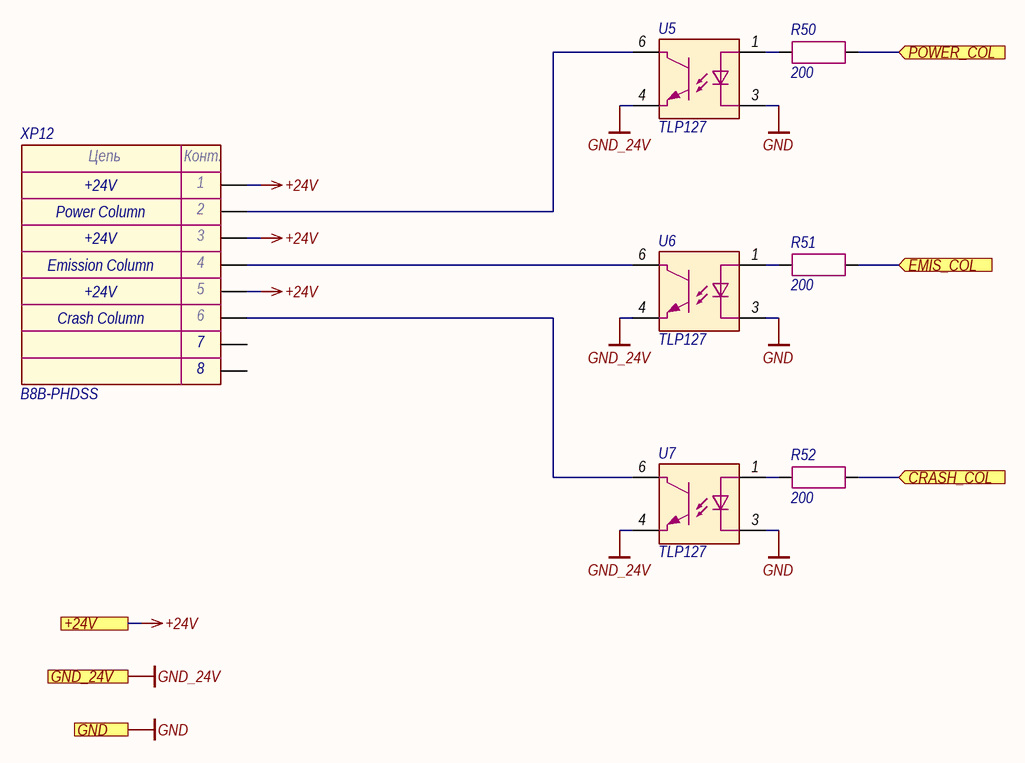
[diagram p10: Column.SchDoc]

### Parts
R50  200  [RES_0603]
R51  200  [RES_0603]
R52  200  [RES_0603]
U5  TLP127  [11-4C1]
U6  TLP127  [11-4C1]
U7  TLP127  [11-4C1]
XP12  B8B-PHDSS  [B8B-PHDSS]

### Ports
+24V (see Main[1C], Button[1C], Flow_sensor[2C], Hardwiring[3C], Indication[1C], LD_driver[1C], Power_supply[1D], Power_supply_CAN[1D]), CRASH_COL (in, see Main[1C]), EMIS_COL (in, see Main[1C]), GND (see Main[1C], Button[1D], Ethernet[3D], Fiber_interlock[2C], Flow_sensor[2C], Guide_laser[1C], Hardwiring[3D], Indication[1C], LD_driver[1D], Power_supply[1D], Power_supply_CAN[1D], SF_driver[2D]), GND_24V (see Main[1C], Button[1D], Flow_sensor[2C], Hardwiring[3C], Indication[1C], LD_driver[1D], Power_supply[1D], Power_supply_CAN[1D]), POWER_COL (in, see Main[1C])

### Nets
+24V: XP12.1 XP12.3 XP12.5 ; port +24V
GND: U5.3 U6.3 U7.3 ; port GND
GND_24V: U5.4 U6.4 U7.4 ; port GND_24V
CRASH_COL: R52.2 ; port CRASH_COL
EMIS_COL: R51.2 ; port EMIS_COL
POWER_COL: R50.2 ; port POWER_COL
NetR50_1: R50.1 U5.1
NetR51_1: R51.1 U6.1
NetR52_1: R52.1 U7.1
NetU5_6: U5.6 XP12.2
NetU6_6: U6.6 XP12.4
NetU7_6: U7.6 XP12.6

Not connected (* = marked no-connect by the designer): XP12 7 8

### Notes on the sheet
- Power Column
- +24V
- Emission Column
- Crash Column
- Подп. и дата
- Инв. № дубл.
- Взам. инв. №
- Инв. № подл.
- Изм.
- Лист
- № докум.
- Подп.
- Дата
- Копировал
- Формат А3
- (in symbol Connector-8) Цепь; Конт.

### Library data of the parts
R50-R52 = Resistor: as R4 on sheet Main; Value: 200; Document: *
U5-U7 = TLP127: Manufacturer: Toshiba; Model: TLP127; Document: *
XP12 = Connector-8: Manufacturer: JST; Model: B8B-PHDSS; Document: *

## Sheet Flow_sensor.SchDoc
size 420 x 297 mm; Address1: Address1; Address2: Address2; Address3: Address3; Address4: Address4; DocumentNumber: *Э3; SheetNumber: 12; SheetTotal: 15; DocumentType: Схема электрическая *
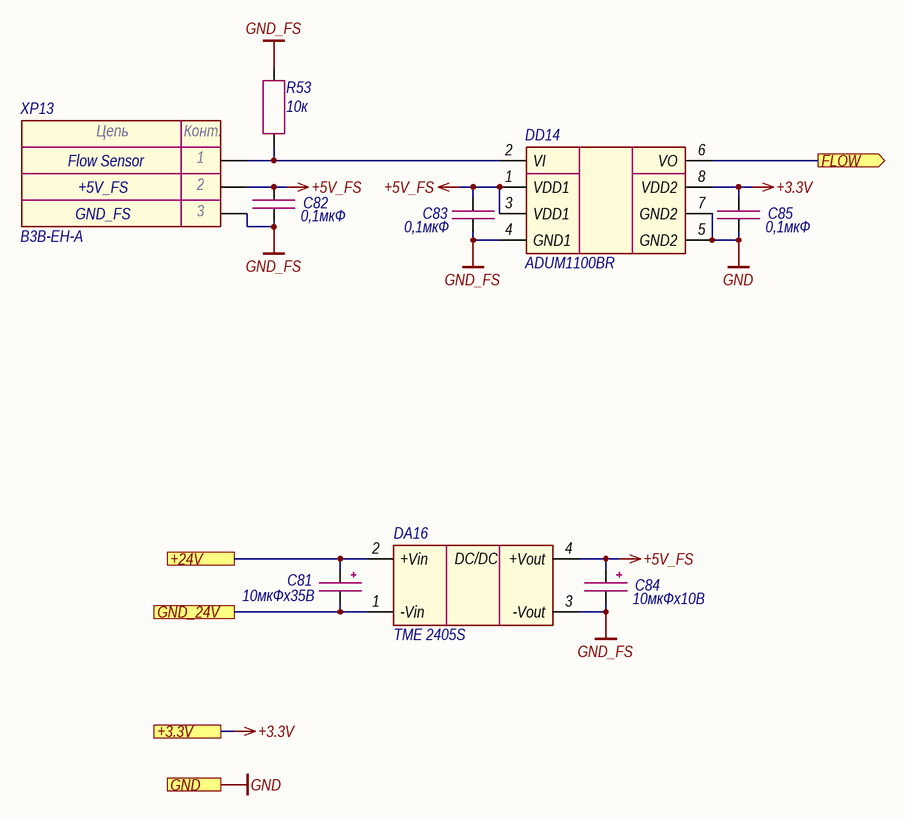
[diagram p11: Flow_sensor.SchDoc]

### Parts
C81  10мкФх35B  [CAP_C]
C82  0,1мкФ  [CAP_0603]
C83  0,1мкФ  [CAP_0603]
C84  10мкФх10B  [CAP_A]
C85  0,1мкФ  [CAP_0603]
DA16  TME 2405S  [TME (SIP-4)]
DD14  ADUM1100BR  [SOIC-8]
R53  10к  [RES_0603]
XP13  B3B-EH-A  [B3B-EH-A]

### Ports
+3.3V (see Main[1C], Button[1D], Ethernet[3D], Fiber_interlock[2C], Hardwiring[3D], LD_driver[1D], Power_supply[1D], Power_supply_CAN[1D], SF_driver[2C]), +24V (see Main[1C], Button[1C], Column[1C], Hardwiring[3C], Indication[1C], LD_driver[1C], Power_supply[1D], Power_supply_CAN[1D]), FLOW (out, see Main[1C]), GND (see Main[1C], Button[1D], Column[1C], Ethernet[3D], Fiber_interlock[2C], Guide_laser[1C], Hardwiring[3D], Indication[1C], LD_driver[1D], Power_supply[1D], Power_supply_CAN[1D], SF_driver[2D]), GND_24V (see Main[1C], Button[1D], Column[1C], Hardwiring[3C], Indication[1C], LD_driver[1D], Power_supply[1D], Power_supply_CAN[1D])

### Nets
+3.3V: C85.1 DD14.8(VDD2) ; port +3.3V
+5V_FS: C82.1 C83.1 C84.1 DA16.4(+Vout) DD14.1(VDD1) DD14.3(VDD1) XP13.2
+24V: C81.1 DA16.2(+Vin) ; port +24V
GND: C85.2 DD14.5(GND2) DD14.7(GND2) ; port GND
GND_24V: C81.2 DA16.1(-Vin) ; port GND_24V
GND_FS: C82.2 C83.2 C84.2 DA16.3(-Vout) DD14.4(GND1) R53.2 XP13.3
FLOW: DD14.6(VO) ; port FLOW
NetDD14_2: DD14.2(VI) R53.1 XP13.1

### Notes on the sheet
- +5V_FS
- Flow Sensor
- GND_FS
- Подп. и дата
- Инв. № дубл.
- Взам. инв. №
- Инв. № подл.
- Изм.
- Лист
- № докум.
- Подп.
- Дата
- Копировал
- Формат А3
- (in symbol Connector-3) Цепь; Конт.
- (in symbol TME) DC/DC

### Library data of the parts
C81 = Capacitor_Polar: Model: TECAP, 10 мкФ, 35 В, тип C, 10%; Value: 10мкФх35B; Document: *; Manufacturer: *
C82 C83 C85 = Capacitor: as C3 on sheet Main; Value: 0,1мкФ; Document: *
C84 = Capacitor_Polar: Model: TECAP, 10 мкФ, 10 В, тип A, 10%; Value: 10мкФх10B; Document: *; Manufacturer: *
DA16 = TME: Manufacturer: Traco Power; Model: TME 2405S; Document: *
DD14 = ADUM1100: Manufacturer: Analog Devices; Model: ADUM1100BR; Document: *
R53 = Resistor: as R3 on sheet Main; Value: 10к; Document: *
XP13 = Connector-3: Manufacturer: JST; Model: B3B-EH-A; Document: *